# EAGLE design modul_relais (EAGLE 7.7.0)

## Sheet 1 of 3
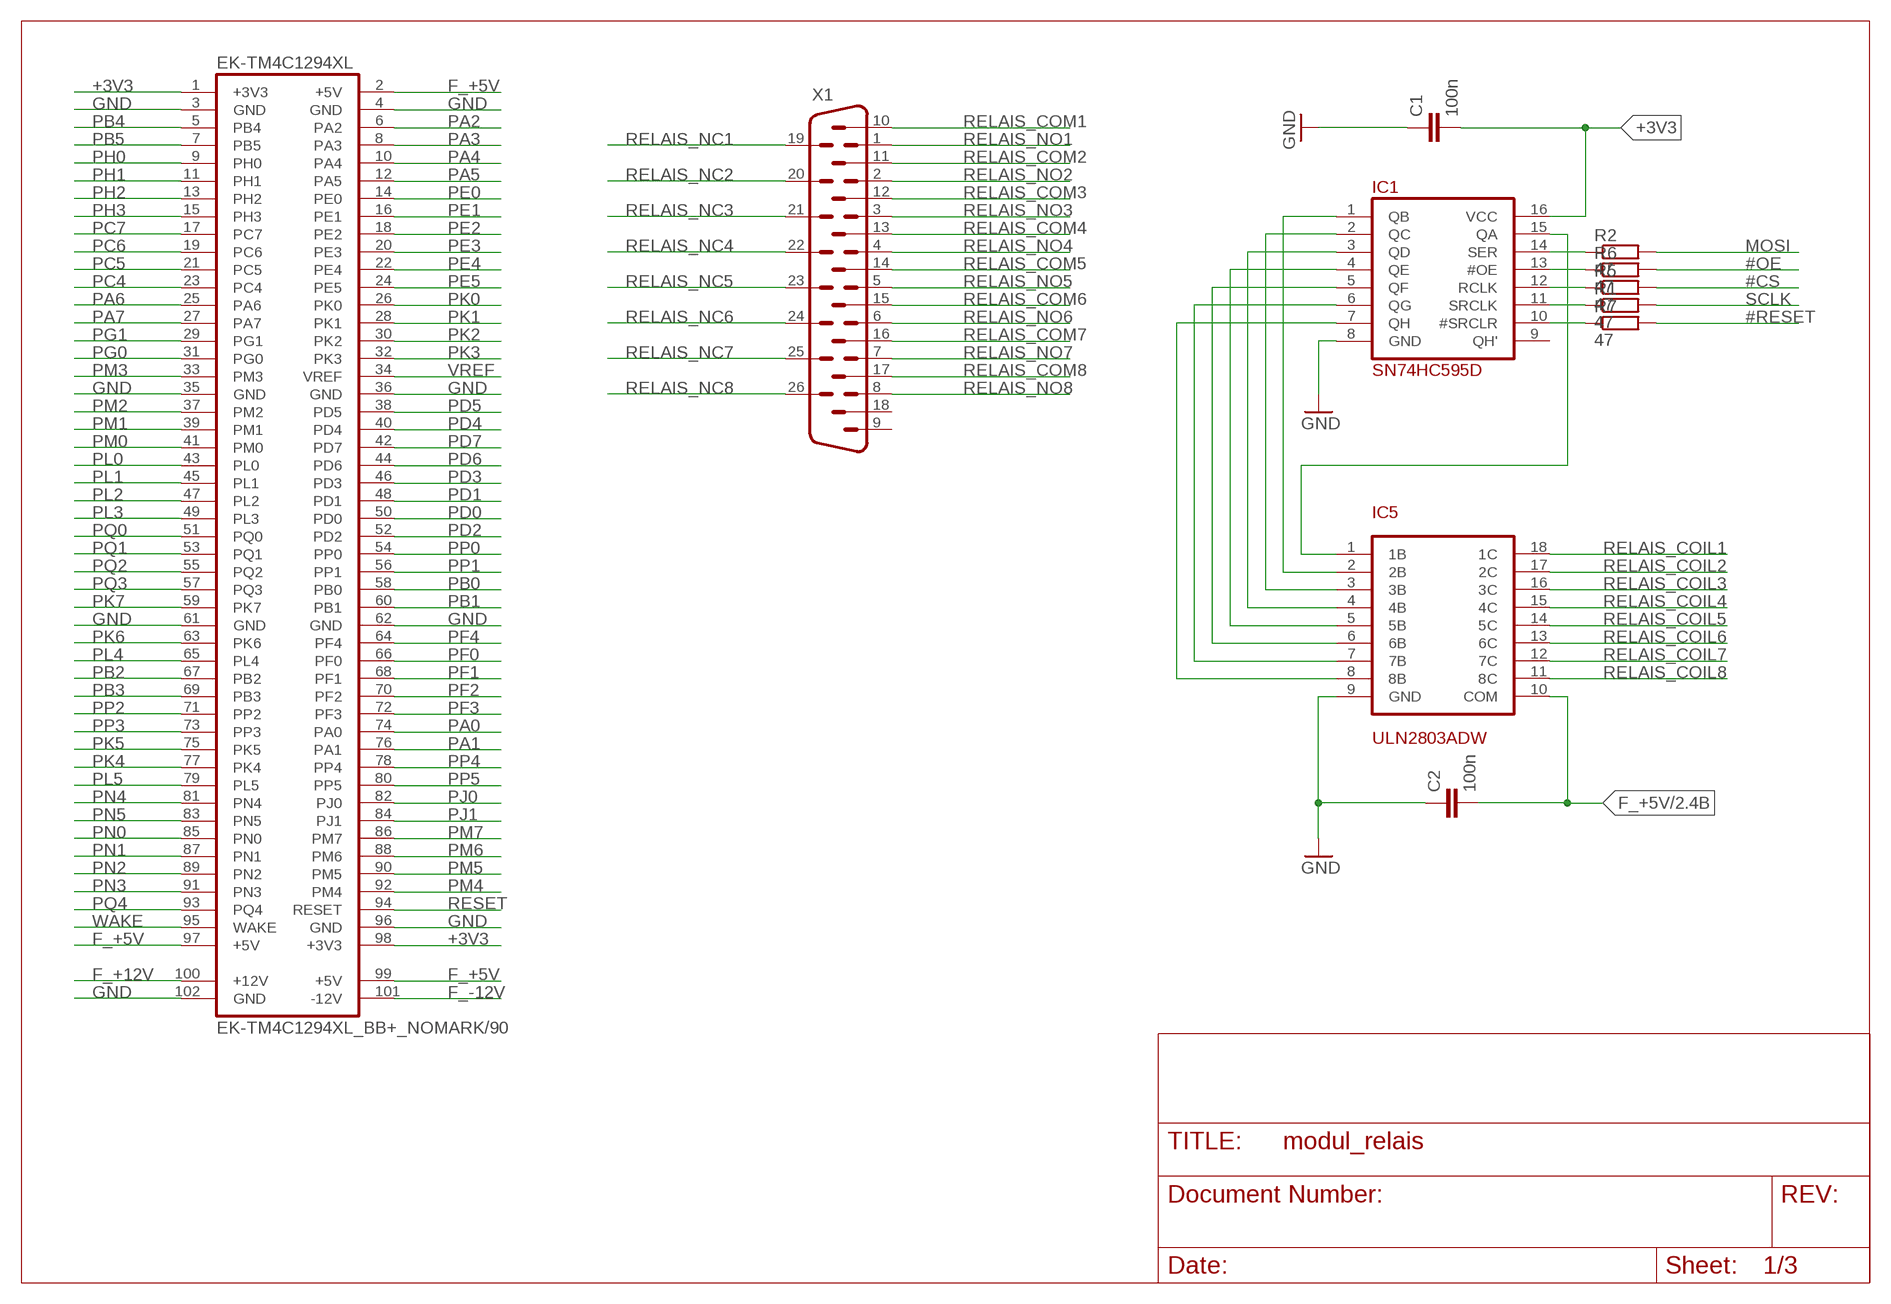
[diagram p0: schematic, sheet 1]

### Parts
C1  100n  C-EUC0805  [C0805]
C2  100n  C-EUC0805  [C0805]
EK-TM4C1294XL  EK-TM4C1294XL_BB+_NOMARK/90  [EK-TM4C1294XL_BB+_NOMARK/90]
IC1  SN74HC595D  [SOIC16_D]
IC5  ULN2803ADW  [SOIC18_DW]
R1  47  R-EU_R0805  [R0805]
R2  47  R-EU_R0805  [R0805]
R5  47  R-EU_R0805  [R0805]
R6  47  R-EU_R0805  [R0805]
R7  47  R-EU_R0805  [R0805]
X1  HM26H  [HDM26H]

### Nets
#CS: R5.2 ; also sheet 3
#OE: R6.2 ; also sheet 3
#RESET: R7.2 ; also sheet 3
+3V3: C1.2 EK-TM4C1294XL.1(+3V3) EK-TM4C1294XL.98(+3V3) IC1.16(VCC) ; also sheet 3
F_+5V: C2.2 EK-TM4C1294XL.2(+5V) EK-TM4C1294XL.97(+5V) EK-TM4C1294XL.99(+5V) IC5.10(COM) ; also sheet 2,3
F_+12V: EK-TM4C1294XL.100(+12V) ; also sheet 3
F_-12V: EK-TM4C1294XL.101(-12V) ; also sheet 3
GND: C1.1 C2.1 EK-TM4C1294XL.3(GND) EK-TM4C1294XL.4(GND) EK-TM4C1294XL.35(GND) EK-TM4C1294XL.36(GND) EK-TM4C1294XL.61(GND) EK-TM4C1294XL.62(GND) EK-TM4C1294XL.96(GND) EK-TM4C1294XL.102(GND) IC1.8(GND) IC5.9(GND) ; also sheet 2,3
MOSI: R2.2 ; also sheet 2
N$1: IC1.14(SER) R2.1
N$2: IC1.13(#OE) R6.1
N$3: IC1.12(RCLK) R5.1
N$4: IC1.11(SRCLK) R1.1
N$5: IC1.10(#SRCLR) R7.1
N$6: IC1.15(QA) IC5.1(1B)
N$7: IC1.1(QB) IC5.2(2B)
N$8: IC1.2(QC) IC5.3(3B)
N$9: IC1.3(QD) IC5.4(4B)
N$11: IC1.4(QE) IC5.5(5B)
N$13: IC1.5(QF) IC5.6(6B)
N$14: IC1.6(QG) IC5.7(7B)
N$15: IC1.7(QH) IC5.8(8B)
PA0: EK-TM4C1294XL.74(PA0) ; also sheet 3
PA1: EK-TM4C1294XL.76(PA1) ; also sheet 3
PA2: EK-TM4C1294XL.6(PA2) ; also sheet 2,3
PA3: EK-TM4C1294XL.8(PA3) ; also sheet 3
PA4: EK-TM4C1294XL.10(PA4) ; also sheet 2,3
PA5: EK-TM4C1294XL.12(PA5) ; also sheet 2,3
PA6: EK-TM4C1294XL.25(PA6) ; also sheet 3
PA7: EK-TM4C1294XL.27(PA7) ; also sheet 3
PB0: EK-TM4C1294XL.58(PB0) ; also sheet 3
PB1: EK-TM4C1294XL.60(PB1) ; also sheet 3
PB2: EK-TM4C1294XL.67(PB2) ; also sheet 3
PB3: EK-TM4C1294XL.69(PB3) ; also sheet 3
PB4: EK-TM4C1294XL.5(PB4) ; also sheet 3
PB5: EK-TM4C1294XL.7(PB5) ; also sheet 2,3
PC4: EK-TM4C1294XL.23(PC4) ; also sheet 3
PC5: EK-TM4C1294XL.21(PC5) ; also sheet 3
PC6: EK-TM4C1294XL.19(PC6) ; also sheet 3
PC7: EK-TM4C1294XL.17(PC7) ; also sheet 3
PD0: EK-TM4C1294XL.50(PD0) ; also sheet 2,3
PD1: EK-TM4C1294XL.48(PD1) ; also sheet 2,3
PD2: EK-TM4C1294XL.52(PD2) ; also sheet 3
PD3: EK-TM4C1294XL.46(PD3) ; also sheet 2,3
PD4: EK-TM4C1294XL.40(PD4) ; also sheet 3
PD5: EK-TM4C1294XL.38(PD5) ; also sheet 3
PD6: EK-TM4C1294XL.44(PD6) ; also sheet 3
PD7: EK-TM4C1294XL.42(PD7) ; also sheet 3
PE0: EK-TM4C1294XL.14(PE0) ; also sheet 3
PE1: EK-TM4C1294XL.16(PE1) ; also sheet 3
PE2: EK-TM4C1294XL.18(PE2) ; also sheet 3
PE3: EK-TM4C1294XL.20(PE3) ; also sheet 3
PE4: EK-TM4C1294XL.22(PE4) ; also sheet 2,3
PE5: EK-TM4C1294XL.24(PE5) ; also sheet 2,3
PF0: EK-TM4C1294XL.66(PF0) ; also sheet 3
PF1: EK-TM4C1294XL.68(PF1) ; also sheet 3
PF2: EK-TM4C1294XL.70(PF2) ; also sheet 3
PF3: EK-TM4C1294XL.72(PF3) ; also sheet 3
PF4: EK-TM4C1294XL.64(PF4) ; also sheet 3
PG0: EK-TM4C1294XL.31(PG0) ; also sheet 3
PG1: EK-TM4C1294XL.29(PG1) ; also sheet 3
PH0: EK-TM4C1294XL.9(PH0) ; also sheet 3
PH1: EK-TM4C1294XL.11(PH1) ; also sheet 3
PH2: EK-TM4C1294XL.13(PH2) ; also sheet 3
PH3: EK-TM4C1294XL.15(PH3) ; also sheet 3
PJ0: EK-TM4C1294XL.82(PJ0) ; also sheet 3
PJ1: EK-TM4C1294XL.84(PJ1) ; also sheet 3
PK0: EK-TM4C1294XL.26(PK0) ; also sheet 3
PK1: EK-TM4C1294XL.28(PK1) ; also sheet 3
PK2: EK-TM4C1294XL.30(PK2) ; also sheet 3
PK3: EK-TM4C1294XL.32(PK3) ; also sheet 3
PK4: EK-TM4C1294XL.77(PK4) ; also sheet 3
PK5: EK-TM4C1294XL.75(PK5) ; also sheet 3
PK6: EK-TM4C1294XL.63(PK6) ; also sheet 3
PK7: EK-TM4C1294XL.59(PK7) ; also sheet 3
PL0: EK-TM4C1294XL.43(PL0) ; also sheet 3
PL1: EK-TM4C1294XL.45(PL1) ; also sheet 3
PL2: EK-TM4C1294XL.47(PL2) ; also sheet 3
PL3: EK-TM4C1294XL.49(PL3) ; also sheet 3
PL4: EK-TM4C1294XL.65(PL4) ; also sheet 3
PL5: EK-TM4C1294XL.79(PL5) ; also sheet 3
PM0: EK-TM4C1294XL.41(PM0) ; also sheet 3
PM1: EK-TM4C1294XL.39(PM1) ; also sheet 3
PM2: EK-TM4C1294XL.37(PM2) ; also sheet 3
PM3: EK-TM4C1294XL.33(PM3) ; also sheet 3
PM4: EK-TM4C1294XL.92(PM4) ; also sheet 3
PM5: EK-TM4C1294XL.90(PM5) ; also sheet 3
PM6: EK-TM4C1294XL.88(PM6) ; also sheet 3
PM7: EK-TM4C1294XL.86(PM7) ; also sheet 3
PN0: EK-TM4C1294XL.85(PN0) ; also sheet 3
PN1: EK-TM4C1294XL.87(PN1) ; also sheet 3
PN2: EK-TM4C1294XL.89(PN2) ; also sheet 3
PN3: EK-TM4C1294XL.91(PN3) ; also sheet 3
PN4: EK-TM4C1294XL.81(PN4) ; also sheet 3
PN5: EK-TM4C1294XL.83(PN5) ; also sheet 3
PP0: EK-TM4C1294XL.54(PP0) ; also sheet 3
PP1: EK-TM4C1294XL.56(PP1) ; also sheet 3
PP2: EK-TM4C1294XL.71(PP2) ; also sheet 3
PP3: EK-TM4C1294XL.73(PP3) ; also sheet 3
PP4: EK-TM4C1294XL.78(PP4) ; also sheet 3
PP5: EK-TM4C1294XL.80(PP5) ; also sheet 3
PQ0: EK-TM4C1294XL.51(PQ0) ; also sheet 2,3
PQ1: EK-TM4C1294XL.53(PQ1) ; also sheet 3
PQ2: EK-TM4C1294XL.55(PQ2) ; also sheet 2,3
PQ3: EK-TM4C1294XL.57(PQ3) ; also sheet 2,3
PQ4: EK-TM4C1294XL.93(PQ4) ; also sheet 3
RELAIS_COIL1: IC5.18(1C) ; also sheet 2
RELAIS_COIL2: IC5.17(2C) ; also sheet 2
RELAIS_COIL3: IC5.16(3C) ; also sheet 2
RELAIS_COIL4: IC5.15(4C) ; also sheet 2
RELAIS_COIL5: IC5.14(5C) ; also sheet 2
RELAIS_COIL6: IC5.13(6C) ; also sheet 2
RELAIS_COIL7: IC5.12(7C) ; also sheet 2
RELAIS_COIL8: IC5.11(8C) ; also sheet 2
RELAIS_COM1: X1.10 ; also sheet 2
RELAIS_COM2: X1.11 ; also sheet 2
RELAIS_COM3: X1.12 ; also sheet 2
RELAIS_COM4: X1.13 ; also sheet 2
RELAIS_COM5: X1.14 ; also sheet 2
RELAIS_COM6: X1.15 ; also sheet 2
RELAIS_COM7: X1.16 ; also sheet 2
RELAIS_COM8: X1.17 ; also sheet 2
RELAIS_NC1: X1.19 ; also sheet 2
RELAIS_NC2: X1.20 ; also sheet 2
RELAIS_NC3: X1.21 ; also sheet 2
RELAIS_NC4: X1.22 ; also sheet 2
RELAIS_NC5: X1.23 ; also sheet 2
RELAIS_NC6: X1.24 ; also sheet 2
RELAIS_NC7: X1.25 ; also sheet 2
RELAIS_NC8: X1.26 ; also sheet 2
RELAIS_NO1: X1.1 ; also sheet 2
RELAIS_NO2: X1.2 ; also sheet 2
RELAIS_NO3: X1.3 ; also sheet 2
RELAIS_NO4: X1.4 ; also sheet 2
RELAIS_NO5: X1.5 ; also sheet 2
RELAIS_NO6: X1.6 ; also sheet 2
RELAIS_NO7: X1.7 ; also sheet 2
RELAIS_NO8: X1.8 ; also sheet 2
RESET: EK-TM4C1294XL.94(RESET) ; also sheet 3
SCLK: R1.2 ; also sheet 2
VREF: EK-TM4C1294XL.34(VREF) ; also sheet 3
WAKE: EK-TM4C1294XL.95(WAKE) ; also sheet 3
Unconnected: IC1.9(QH') X1.9 X1.18

## Sheet 2 of 3
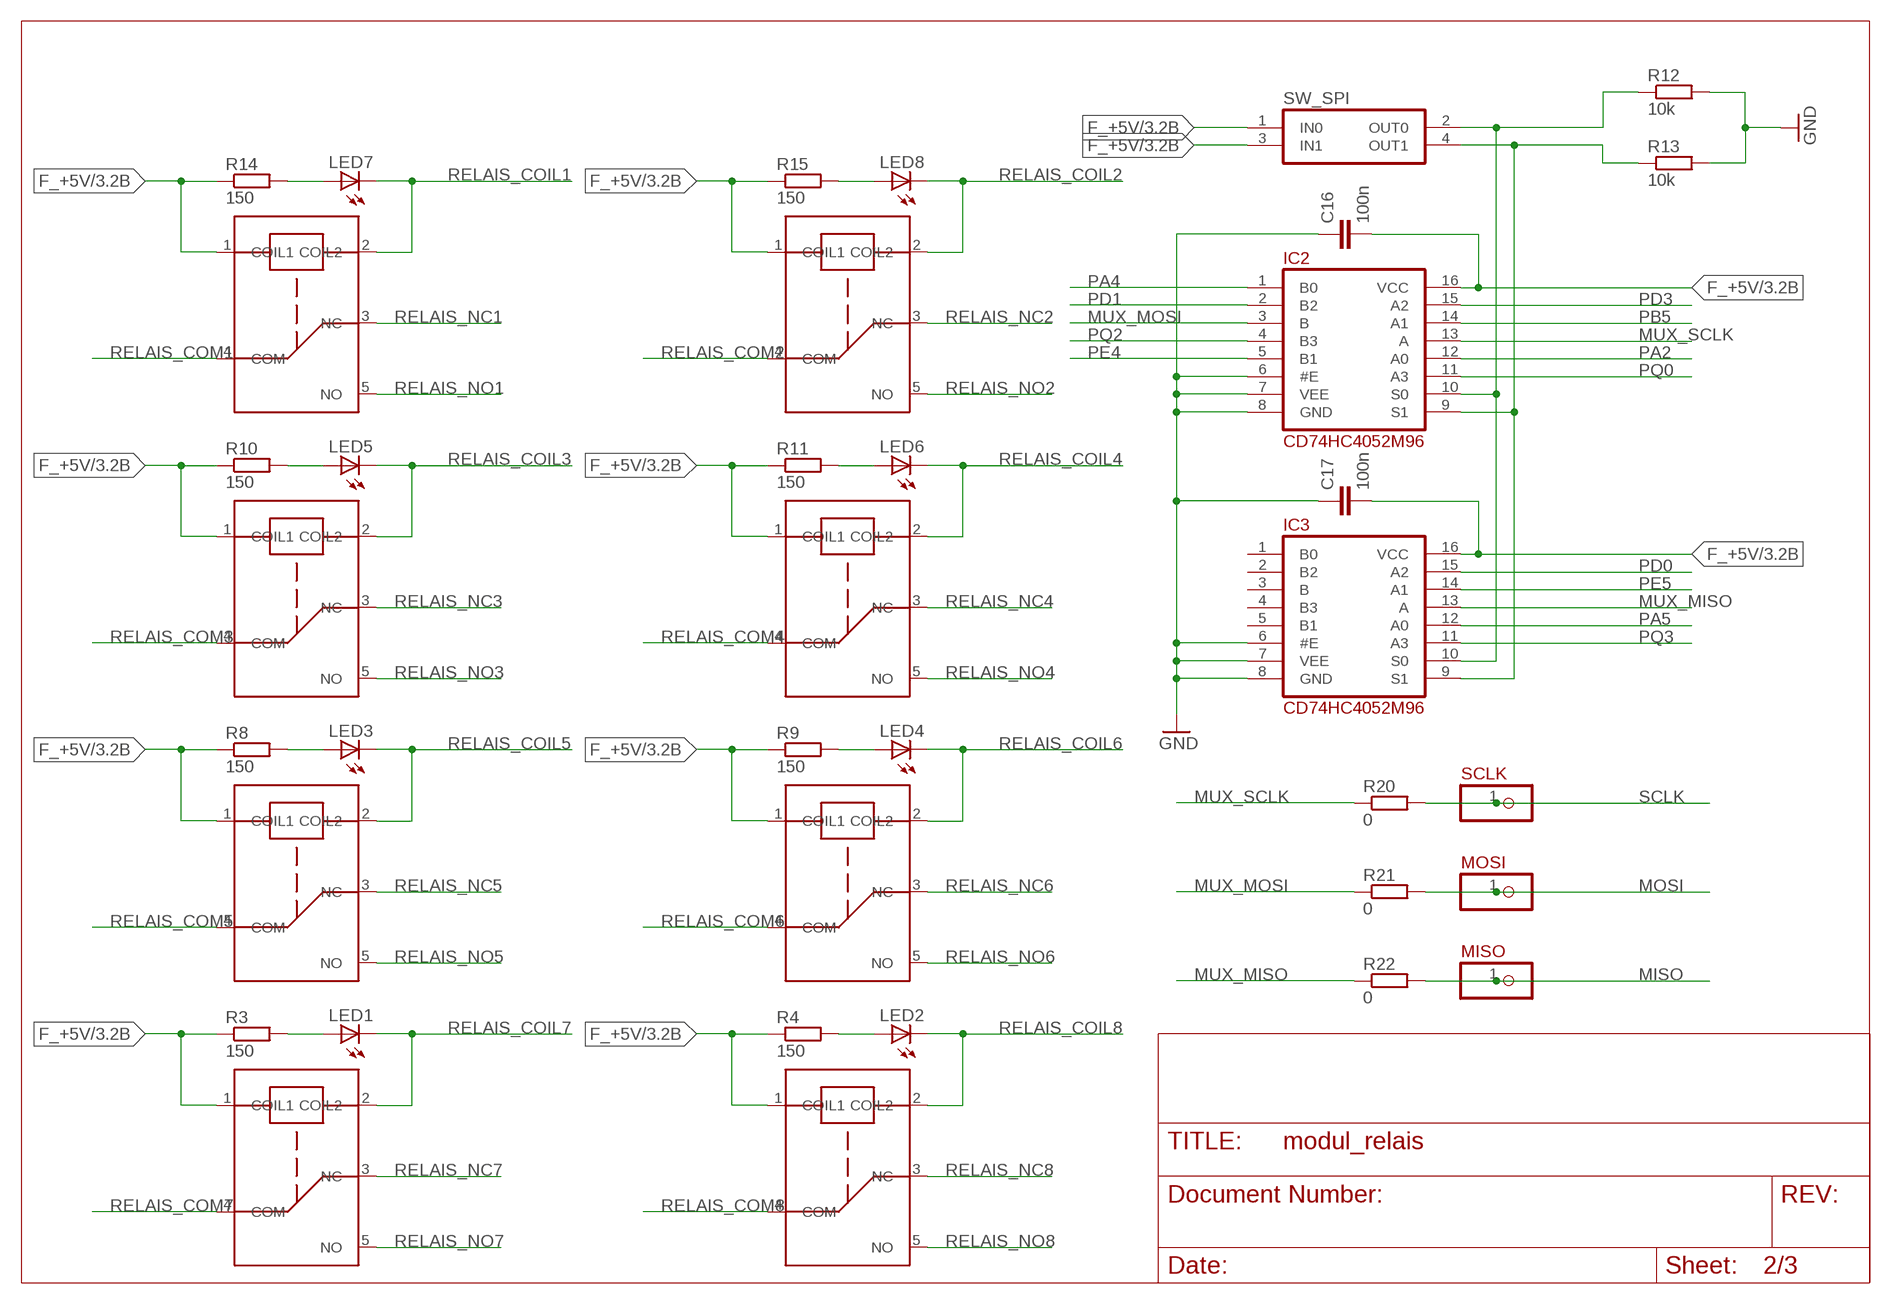
[diagram p1: schematic, sheet 2]

### Parts
C16  100n  C-EUC0805  [C0805]
C17  100n  C-EUC0805  [C0805]
IC2  CD74HC4052M96  [SOIC16_D]
IC3  CD74HC4052M96  [SOIC16_D]
LED1  LEDCHIP-LED0805  [CHIP-LED0805]
LED2  LEDCHIP-LED0805  [CHIP-LED0805]
LED3  LEDCHIP-LED0805  [CHIP-LED0805]
LED4  LEDCHIP-LED0805  [CHIP-LED0805]
LED5  LEDCHIP-LED0805  [CHIP-LED0805]
LED6  LEDCHIP-LED0805  [CHIP-LED0805]
LED7  LEDCHIP-LED0805  [CHIP-LED0805]
LED8  LEDCHIP-LED0805  [CHIP-LED0805]
MISO  PINH-1X1  [1X1]
MOSI  PINH-1X1  [1X1]
R3  150  R-EU_R0805  [R0805]
R4  150  R-EU_R0805  [R0805]
R8  150  R-EU_R0805  [R0805]
R9  150  R-EU_R0805  [R0805]
R10  150  R-EU_R0805  [R0805]
R11  150  R-EU_R0805  [R0805]
R12  10k  R-EU_R0805  [R0805]
R13  10k  R-EU_R0805  [R0805]
R14  150  R-EU_R0805  [R0805]
R15  150  R-EU_R0805  [R0805]
R20  0  R-EU_R0805  [R0805]
R21  0  R-EU_R0805  [R0805]
R22  0  R-EU_R0805  [R0805]
SCLK  PINH-1X1  [1X1]
SW_SPI  NT02  [NT02]
U$1  APF30  [RELAIS]
U$2  APF30  [RELAIS]
U$3  APF30  [RELAIS]
U$4  APF30  [RELAIS]
U$5  APF30  [RELAIS]
U$6  APF30  [RELAIS]
U$7  APF30  [RELAIS]
U$8  APF30  [RELAIS]

### Nets
F_+5V: C16.2 C17.2 IC2.16(VCC) IC3.16(VCC) R3.1 R4.1 R8.1 R9.1 R10.1 R11.1 R14.1 R15.1 SW_SPI.1(IN0) SW_SPI.3(IN1) U$1.1(COIL1) U$2.1(COIL1) U$3.1(COIL1) U$4.1(COIL1) U$5.1(COIL1) U$6.1(COIL1) U$7.1(COIL1) U$8.1(COIL1) ; also sheet 1,3
GND: C16.1 C17.1 IC2.6(#E) IC2.7(VEE) IC2.8(GND) IC3.6(#E) IC3.7(VEE) IC3.8(GND) R12.2 R13.2 ; also sheet 1,3
MISO: MISO.1 R22.2
MOSI: MOSI.1 R21.2 ; also sheet 1
MUX_MISO: IC3.13(A) R22.1
MUX_MOSI: IC2.3(B) R21.1
MUX_SCLK: IC2.13(A) R20.1
N$16: IC2.10(S0) IC3.10(S0) R12.1 SW_SPI.2(OUT0)
N$17: IC2.9(S1) IC3.9(S1) R13.1 SW_SPI.4(OUT1)
N$19: LED2.A R4.2
N$20: LED1.A R3.2
N$21: LED3.A R8.2
N$22: LED4.A R9.2
N$23: LED5.A R10.2
N$25: LED6.A R11.2
N$26: LED7.A R14.2
N$27: LED8.A R15.2
PA2: IC2.12(A0) ; also sheet 1,3
PA4: IC2.1(B0) ; also sheet 1,3
PA5: IC3.12(A0) ; also sheet 1,3
PB5: IC2.14(A1) ; also sheet 1,3
PD0: IC3.15(A2) ; also sheet 1,3
PD1: IC2.2(B2) ; also sheet 1,3
PD3: IC2.15(A2) ; also sheet 1,3
PE4: IC2.5(B1) ; also sheet 1,3
PE5: IC3.14(A1) ; also sheet 1,3
PQ0: IC2.11(A3) ; also sheet 1,3
PQ2: IC2.4(B3) ; also sheet 1,3
PQ3: IC3.11(A3) ; also sheet 1,3
RELAIS_COIL1: LED7.C U$7.2(COIL2) ; also sheet 1
RELAIS_COIL2: LED8.C U$8.2(COIL2) ; also sheet 1
RELAIS_COIL3: LED5.C U$5.2(COIL2) ; also sheet 1
RELAIS_COIL4: LED6.C U$6.2(COIL2) ; also sheet 1
RELAIS_COIL5: LED3.C U$3.2(COIL2) ; also sheet 1
RELAIS_COIL6: LED4.C U$4.2(COIL2) ; also sheet 1
RELAIS_COIL7: LED1.C U$1.2(COIL2) ; also sheet 1
RELAIS_COIL8: LED2.C U$2.2(COIL2) ; also sheet 1
RELAIS_COM1: U$7.4(COM) ; also sheet 1
RELAIS_COM2: U$8.4(COM) ; also sheet 1
RELAIS_COM3: U$5.4(COM) ; also sheet 1
RELAIS_COM4: U$6.4(COM) ; also sheet 1
RELAIS_COM5: U$3.4(COM) ; also sheet 1
RELAIS_COM6: U$4.4(COM) ; also sheet 1
RELAIS_COM7: U$1.4(COM) ; also sheet 1
RELAIS_COM8: U$2.4(COM) ; also sheet 1
RELAIS_NC1: U$7.3(NC) ; also sheet 1
RELAIS_NC2: U$8.3(NC) ; also sheet 1
RELAIS_NC3: U$5.3(NC) ; also sheet 1
RELAIS_NC4: U$6.3(NC) ; also sheet 1
RELAIS_NC5: U$3.3(NC) ; also sheet 1
RELAIS_NC6: U$4.3(NC) ; also sheet 1
RELAIS_NC7: U$1.3(NC) ; also sheet 1
RELAIS_NC8: U$2.3(NC) ; also sheet 1
RELAIS_NO1: U$7.5(NO) ; also sheet 1
RELAIS_NO2: U$8.5(NO) ; also sheet 1
RELAIS_NO3: U$5.5(NO) ; also sheet 1
RELAIS_NO4: U$6.5(NO) ; also sheet 1
RELAIS_NO5: U$3.5(NO) ; also sheet 1
RELAIS_NO6: U$4.5(NO) ; also sheet 1
RELAIS_NO7: U$1.5(NO) ; also sheet 1
RELAIS_NO8: U$2.5(NO) ; also sheet 1
SCLK: R20.2 SCLK.1 ; also sheet 1
Unconnected: IC3.1(B0) IC3.2(B2) IC3.3(B) IC3.4(B3) IC3.5(B1)

## Sheet 3 of 3
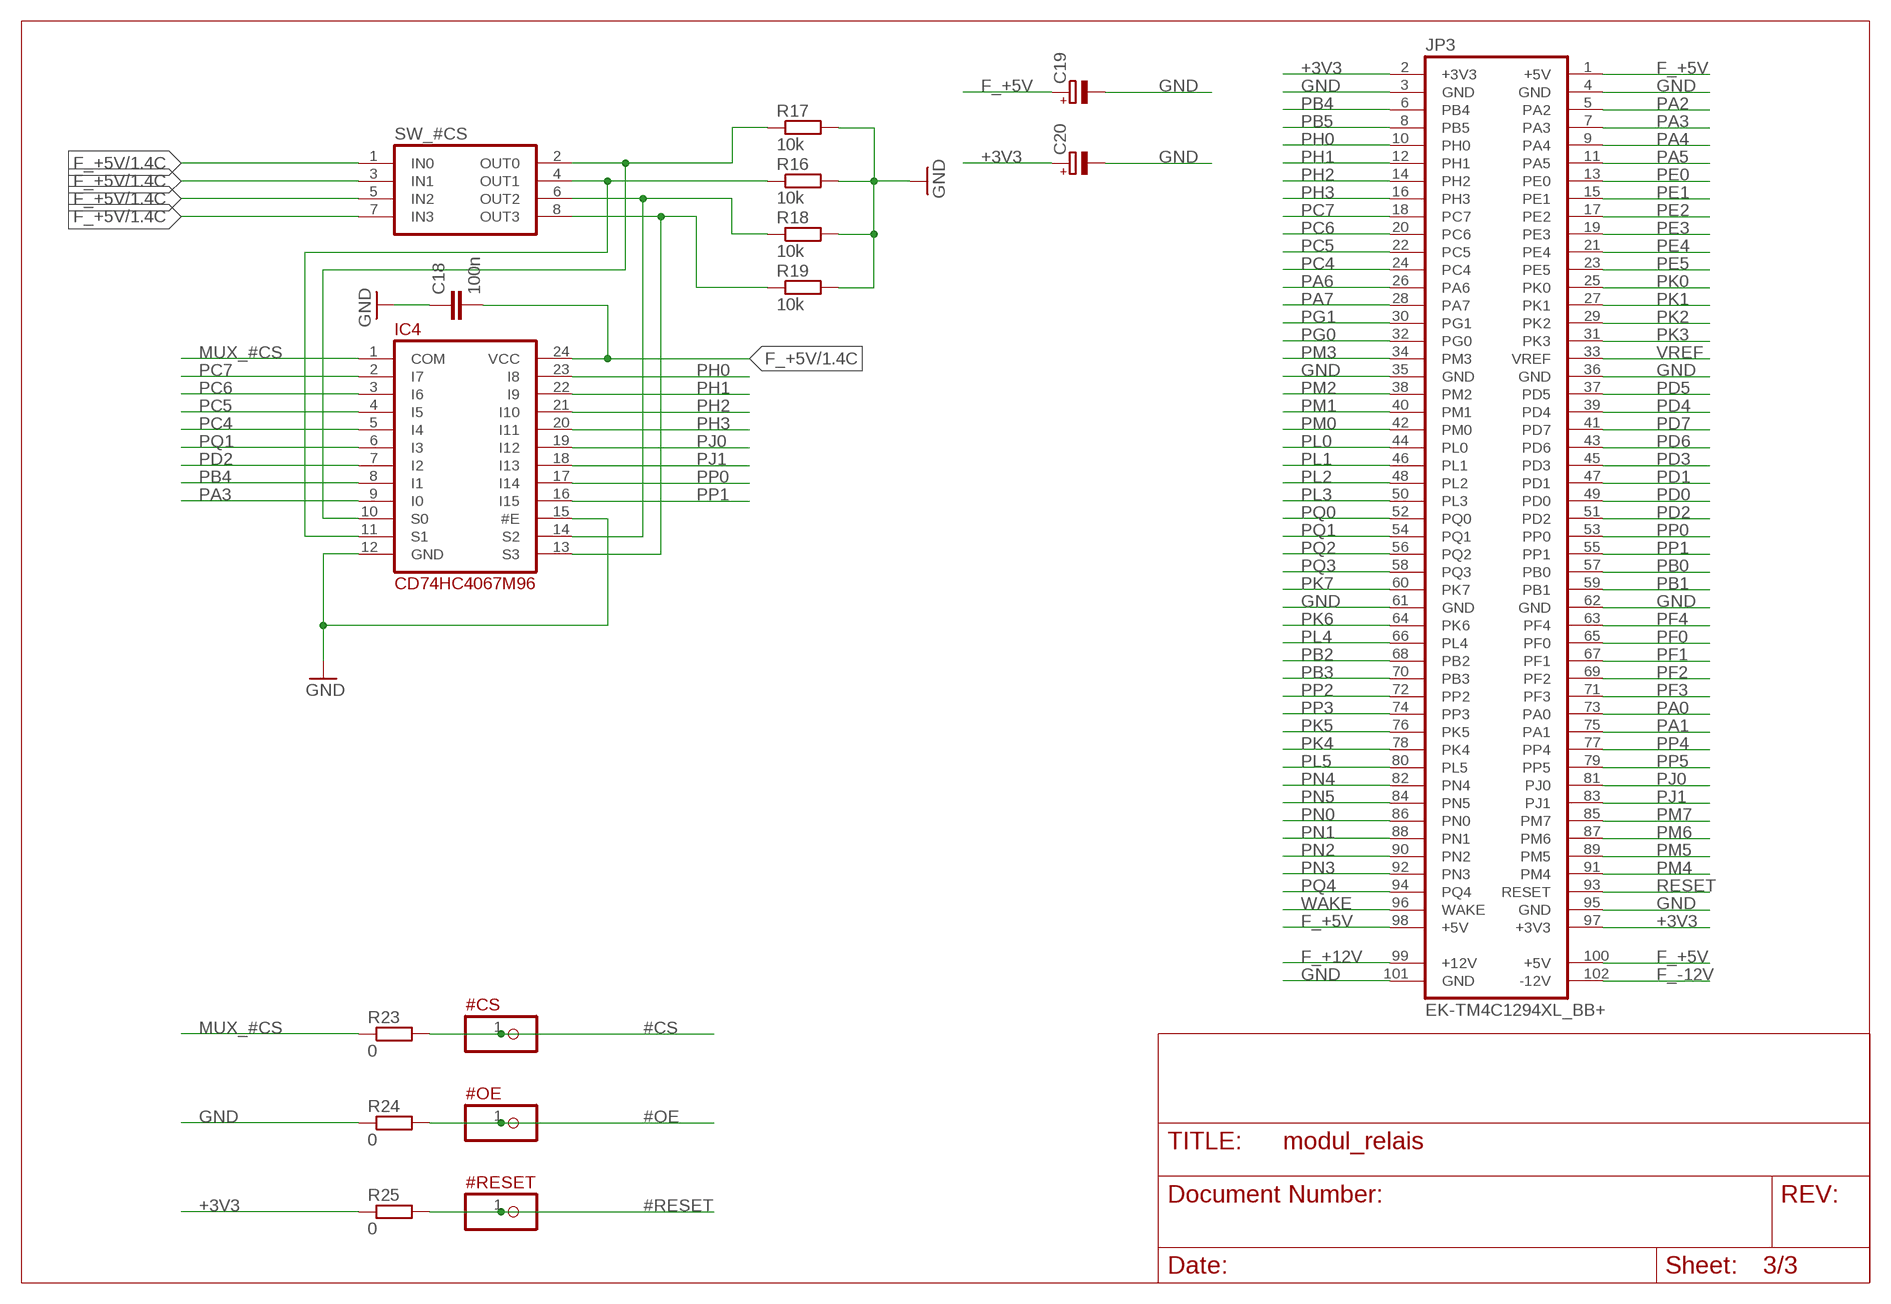
[diagram p2: schematic, sheet 3]

### Parts
#CS  PINH-1X1  [1X1]
#OE  PINH-1X1  [1X1]
#RESET  PINH-1X1  [1X1]
C18  100n  C-EUC0805  [C0805]
C19  CPOL-EUE2.5-6  [E2,5-6]
C20  CPOL-EUE2.5-6  [E2,5-6]
IC4  CD74HC4067M96  [SOIC24_DW]
JP3  EK-TM4C1294XL_BB+  [EK-TM4C1294XL_BB+]
R16  10k  R-EU_R0805  [R0805]
R17  10k  R-EU_R0805  [R0805]
R18  10k  R-EU_R0805  [R0805]
R19  10k  R-EU_R0805  [R0805]
R23  0  R-EU_R0805  [R0805]
R24  0  R-EU_R0805  [R0805]
R25  0  R-EU_R0805  [R0805]
SW_#CS  NT04  [NT04]

### Nets
#CS: #CS.1 R23.2 ; also sheet 1
#OE: #OE.1 R24.2 ; also sheet 1
#RESET: #RESET.1 R25.2 ; also sheet 1
+3V3: C20.+ JP3.2(+3V3) JP3.97(+3V3) R25.1 ; also sheet 1
F_+5V: C18.2 C19.+ IC4.24(VCC) JP3.1(+5V) JP3.98(+5V) JP3.100(+5V) SW_#CS.1(IN0) SW_#CS.3(IN1) SW_#CS.5(IN2) SW_#CS.7(IN3) ; also sheet 1,2
F_+12V: JP3.99(+12V) ; also sheet 1
F_-12V: JP3.102(-12V) ; also sheet 1
GND: C18.1 C19.- C20.- IC4.12(GND) IC4.15(#E) JP3.3(GND) JP3.4(GND) JP3.35(GND) JP3.36(GND) JP3.61(GND) JP3.62(GND) JP3.95(GND) JP3.101(GND) R16.2 R17.2 R18.2 R19.2 R24.1 ; also sheet 1,2
MUX_#CS: IC4.1(COM) R23.1
N$10: IC4.11(S1) R16.1 SW_#CS.4(OUT1)
N$12: IC4.10(S0) R17.1 SW_#CS.2(OUT0)
N$18: IC4.14(S2) R18.1 SW_#CS.6(OUT2)
N$24: IC4.13(S3) R19.1 SW_#CS.8(OUT3)
PA0: JP3.73(PA0) ; also sheet 1
PA1: JP3.75(PA1) ; also sheet 1
PA2: JP3.5(PA2) ; also sheet 1,2
PA3: IC4.9(I0) JP3.7(PA3) ; also sheet 1
PA4: JP3.9(PA4) ; also sheet 1,2
PA5: JP3.11(PA5) ; also sheet 1,2
PA6: JP3.26(PA6) ; also sheet 1
PA7: JP3.28(PA7) ; also sheet 1
PB0: JP3.57(PB0) ; also sheet 1
PB1: JP3.59(PB1) ; also sheet 1
PB2: JP3.68(PB2) ; also sheet 1
PB3: JP3.70(PB3) ; also sheet 1
PB4: IC4.8(I1) JP3.6(PB4) ; also sheet 1
PB5: JP3.8(PB5) ; also sheet 1,2
PC4: IC4.5(I4) JP3.24(PC4) ; also sheet 1
PC5: IC4.4(I5) JP3.22(PC5) ; also sheet 1
PC6: IC4.3(I6) JP3.20(PC6) ; also sheet 1
PC7: IC4.2(I7) JP3.18(PC7) ; also sheet 1
PD0: JP3.49(PD0) ; also sheet 1,2
PD1: JP3.47(PD1) ; also sheet 1,2
PD2: IC4.7(I2) JP3.51(PD2) ; also sheet 1
PD3: JP3.45(PD3) ; also sheet 1,2
PD4: JP3.39(PD4) ; also sheet 1
PD5: JP3.37(PD5) ; also sheet 1
PD6: JP3.43(PD6) ; also sheet 1
PD7: JP3.41(PD7) ; also sheet 1
PE0: JP3.13(PE0) ; also sheet 1
PE1: JP3.15(PE1) ; also sheet 1
PE2: JP3.17(PE2) ; also sheet 1
PE3: JP3.19(PE3) ; also sheet 1
PE4: JP3.21(PE4) ; also sheet 1,2
PE5: JP3.23(PE5) ; also sheet 1,2
PF0: JP3.65(PF0) ; also sheet 1
PF1: JP3.67(PF1) ; also sheet 1
PF2: JP3.69(PF2) ; also sheet 1
PF3: JP3.71(PF3) ; also sheet 1
PF4: JP3.63(PF4) ; also sheet 1
PG0: JP3.32(PG0) ; also sheet 1
PG1: JP3.30(PG1) ; also sheet 1
PH0: IC4.23(I8) JP3.10(PH0) ; also sheet 1
PH1: IC4.22(I9) JP3.12(PH1) ; also sheet 1
PH2: IC4.21(I10) JP3.14(PH2) ; also sheet 1
PH3: IC4.20(I11) JP3.16(PH3) ; also sheet 1
PJ0: IC4.19(I12) JP3.81(PJ0) ; also sheet 1
PJ1: IC4.18(I13) JP3.83(PJ1) ; also sheet 1
PK0: JP3.25(PK0) ; also sheet 1
PK1: JP3.27(PK1) ; also sheet 1
PK2: JP3.29(PK2) ; also sheet 1
PK3: JP3.31(PK3) ; also sheet 1
PK4: JP3.78(PK4) ; also sheet 1
PK5: JP3.76(PK5) ; also sheet 1
PK6: JP3.64(PK6) ; also sheet 1
PK7: JP3.60(PK7) ; also sheet 1
PL0: JP3.44(PL0) ; also sheet 1
PL1: JP3.46(PL1) ; also sheet 1
PL2: JP3.48(PL2) ; also sheet 1
PL3: JP3.50(PL3) ; also sheet 1
PL4: JP3.66(PL4) ; also sheet 1
PL5: JP3.80(PL5) ; also sheet 1
PM0: JP3.42(PM0) ; also sheet 1
PM1: JP3.40(PM1) ; also sheet 1
PM2: JP3.38(PM2) ; also sheet 1
PM3: JP3.34(PM3) ; also sheet 1
PM4: JP3.91(PM4) ; also sheet 1
PM5: JP3.89(PM5) ; also sheet 1
PM6: JP3.87(PM6) ; also sheet 1
PM7: JP3.85(PM7) ; also sheet 1
PN0: JP3.86(PN0) ; also sheet 1
PN1: JP3.88(PN1) ; also sheet 1
PN2: JP3.90(PN2) ; also sheet 1
PN3: JP3.92(PN3) ; also sheet 1
PN4: JP3.82(PN4) ; also sheet 1
PN5: JP3.84(PN5) ; also sheet 1
PP0: IC4.17(I14) JP3.53(PP0) ; also sheet 1
PP1: IC4.16(I15) JP3.55(PP1) ; also sheet 1
PP2: JP3.72(PP2) ; also sheet 1
PP3: JP3.74(PP3) ; also sheet 1
PP4: JP3.77(PP4) ; also sheet 1
PP5: JP3.79(PP5) ; also sheet 1
PQ0: JP3.52(PQ0) ; also sheet 1,2
PQ1: IC4.6(I3) JP3.54(PQ1) ; also sheet 1
PQ2: JP3.56(PQ2) ; also sheet 1,2
PQ3: JP3.58(PQ3) ; also sheet 1,2
PQ4: JP3.94(PQ4) ; also sheet 1
RESET: JP3.93(RESET) ; also sheet 1
VREF: JP3.33(VREF) ; also sheet 1
WAKE: JP3.96(WAKE) ; also sheet 1

## Library data of the parts
#CS #OE #RESET MISO MOSI SCLK = ownparts:PINH-1X1*: 1x1 pol. Stiftleisten, RM 2.54
C1 C2 C16-C18 = rcl:C-EU: CAPACITOR, European symbol
C19 C20 = rcl:CPOL-EU: POLARIZED CAPACITOR, European symbol
EK-TM4C1294XL JP3 = ownparts:EK-TM4C1294XL_BB+
IC1 = ownparts:SN74HC595*
IC2 IC3 = ownparts:CD74HC4052*
IC4 = ownparts:CD74HC4067*
IC5 = ownparts:ULN2803A
LED1-LED8 = led:LED: LED
R1-R25 = rcl:R-EU_: RESISTOR, European symbol
SW_#CS = ownparts:NT04
SW_SPI = ownparts:NT02
U$1-U$8 = ownparts:APF30
X1 = con-subd:HM26: SUB-D; OC_FARNELL: unknown; OC_NEWARK: unknown

## Board
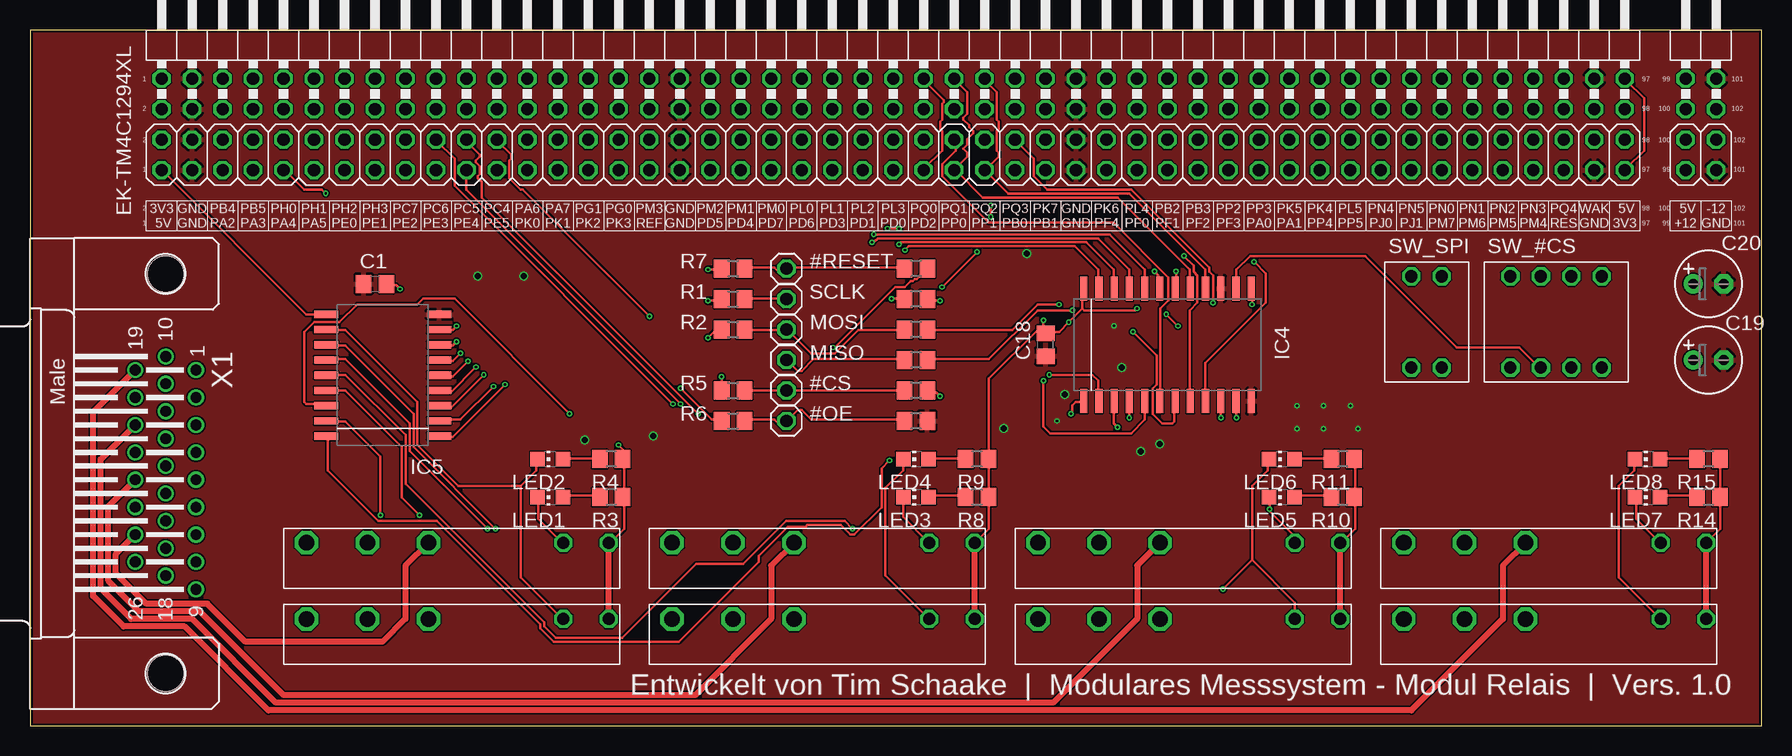
[diagram p3: board, top side]
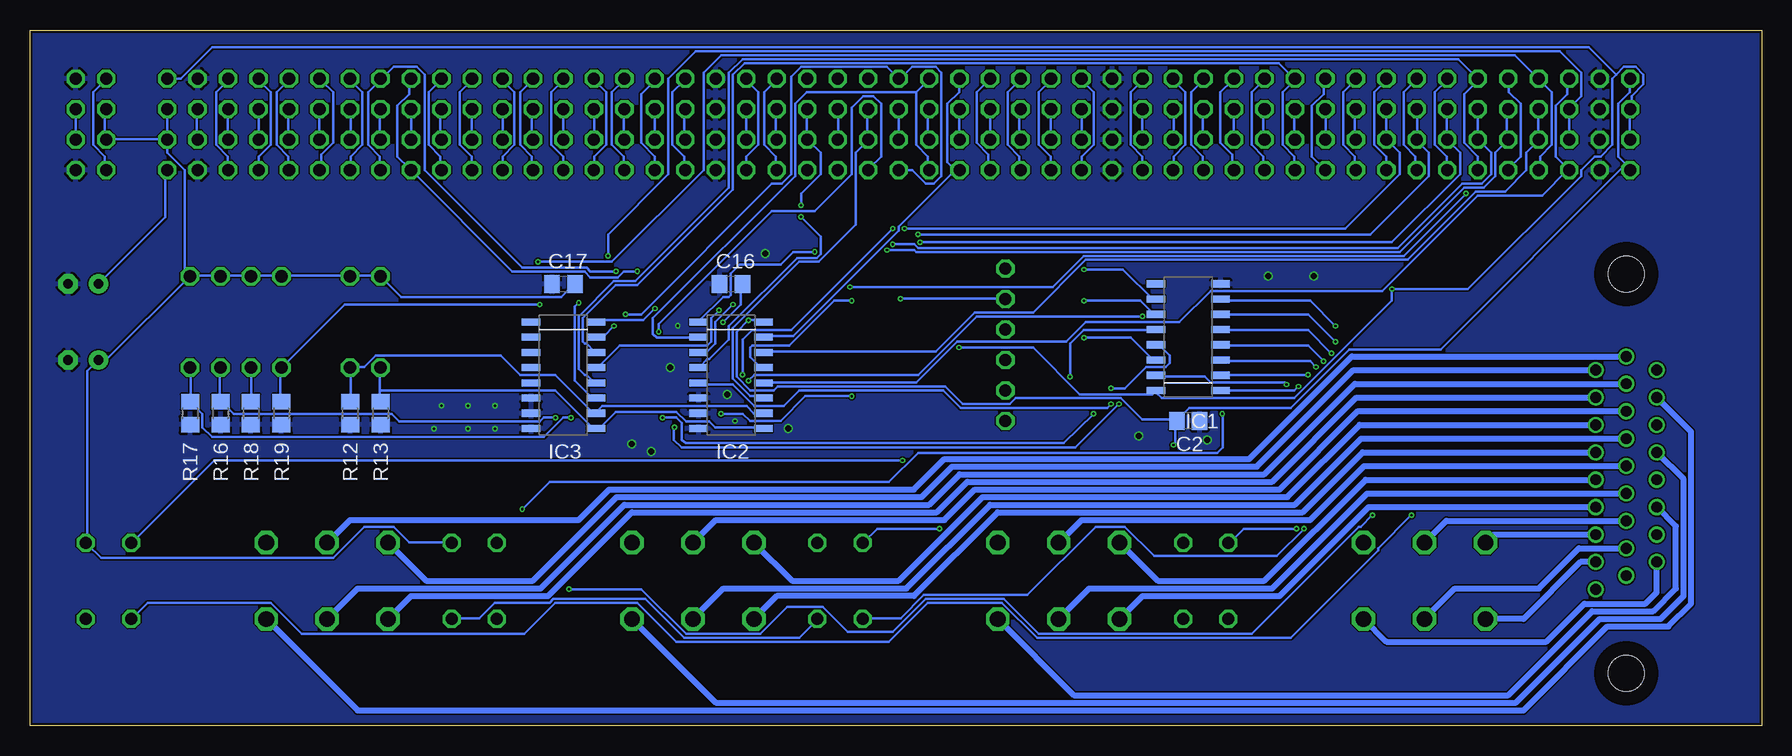
[diagram p4: board, bottom side, seen from below]

Size 144.32 x 58 mm. Coordinates in mm from the lower left corner, seen from the top.
Outline: 0,0 144.32,0 144.32,58 0,58 0,0
Copper layers (1*16): Top 0.018mm / dielectric 1.55mm / Bottom 0.018mm
Design rules "Multi-CB_2L_125um-Tracks_OL35um": minimum track width 0.125mm, minimum drill 0.2mm, track to track 0.125mm, track to pad 0.125mm, pad to pad 0.125mm, via to via 0.125mm, smd to smd 0mil, copper to edge 0.2mm, drill to drill 0.2mm, minimum pad ring 0.125mm, minimum via ring 0.125mm, stop-mask expansion 2mil, vias tented up to drill 0.45mm, thermal gap 0.2mm

### Footprints (pad centres in the part's own frame; a part is rotated, then mirrored left to right if it is on the bottom)
1X1 = drill 1.016 octagon: 1 0,0
C0805 = smd 1.3 x 1.5: 1 -0.95,0; 2 0.95,0
E2,5-6 = drill 0.813 pad 1.6: + -1.27,0 | drill 0.813 pad 1.6 octagon: - 1.27,0
EK-TM4C1294XL_BB+_NOMARK/90 = drill 1.016 octagon: 1 -60.96,-1.27; 2 -60.96,1.27; 3 -58.42,-1.27; 4 -58.42,1.27; 5 -55.88,-1.27; 6 -55.88,1.27; 7 -53.34,-1.27; 8 -53.34,1.27; 9 -50.8,-1.27; 10 -50.8,1.27; 11 -48.26,-1.27; 12 -48.26,1.27; 13 -45.72,-1.27; 14 -45.72,1.27; 15 -43.18,-1.27; 16 -43.18,1.27; 17 -40.64,-1.27; 18 -40.64,1.27; 19 -38.1,-1.27; 20 -38.1,1.27; 21 -35.56,-1.27; 22 -35.56,1.27; 23 -33.02,-1.27; 24 -33.02,1.27; 25 -30.48,-1.27; 26 -30.48,1.27; 27 -27.94,-1.27; 28 -27.94,1.27; 29 -25.4,-1.27; 30 -25.4,1.27; 31 -22.86,-1.27; 32 -22.86,1.27; 33 -20.32,-1.27; 34 -20.32,1.27; 35 -17.78,-1.27; 36 -17.78,1.27; 37 -15.24,-1.27; 38 -15.24,1.27; 39 -12.7,-1.27; 40 -12.7,1.27; 41 -10.16,-1.27; 42 -10.16,1.27; 43 -7.62,-1.27; 44 -7.62,1.27; 45 -5.08,-1.27; 46 -5.08,1.27; 47 -2.54,-1.27; 48 -2.54,1.27; 49 0,-1.27; 50 0,1.27; 51 2.54,-1.27; 52 2.54,1.27; 53 5.08,-1.27; 54 5.08,1.27; 55 7.62,-1.27; 56 7.62,1.27; 57 10.16,-1.27; 58 10.16,1.27; 59 12.7,-1.27; 60 12.7,1.27; 61 15.24,-1.27; 62 15.24,1.27; 63 17.78,-1.27; 64 17.78,1.27; 65 20.32,-1.27; 66 20.32,1.27; 67 22.86,-1.27; 68 22.86,1.27; 69 25.4,-1.27; 70 25.4,1.27; 71 27.94,-1.27; 72 27.94,1.27; 73 30.48,-1.27; 74 30.48,1.27; 75 33.02,-1.27; 76 33.02,1.27; 77 35.56,-1.27; 78 35.56,1.27; 79 38.1,-1.27; 80 38.1,1.27; 81 40.64,-1.27; 82 40.64,1.27; 83 43.18,-1.27; 84 43.18,1.27; 85 45.72,-1.27; 86 45.72,1.27; 87 48.26,-1.27; 88 48.26,1.27; 89 50.8,-1.27; 90 50.8,1.27; 91 53.34,-1.27; 92 53.34,1.27; 93 55.88,-1.27; 94 55.88,1.27; 95 58.42,-1.27; 96 58.42,1.27; 97 60.96,-1.27; 98 60.96,1.27; 99 66.04,-1.27; 100 66.04,1.27; 101 68.58,-1.27; 102 68.58,1.27
SOIC16_D = smd 0.6 x 1.55: 1 -4.445,-2.7; 2 -3.175,-2.7; 3 -1.905,-2.7; 4 -0.635,-2.7; 5 0.635,-2.7; 6 1.905,-2.7; 7 3.175,-2.7; 8 4.445,-2.7; 9 4.445,2.7; 10 3.175,2.7; 11 1.905,2.7; 12 0.635,2.7; 13 -0.635,2.7; 14 -1.905,2.7; 15 -3.175,2.7; 16 -4.445,2.7
SOIC24_DW = smd 0.6 x 2: 1 -6.985,-4.7; 2 -5.715,-4.7; 3 -4.445,-4.7; 4 -3.175,-4.7; 5 -1.905,-4.7; 6 -0.635,-4.7; 7 0.635,-4.7; 8 1.905,-4.7; 9 3.175,-4.7; 10 4.445,-4.7; 11 5.715,-4.7; 12 6.985,-4.7; 13 6.985,4.7; 14 5.715,4.7; 15 4.445,4.7; 16 3.175,4.7; 17 1.905,4.7; 18 0.635,4.7; 19 -0.635,4.7; 20 -1.905,4.7; 21 -3.175,4.7; 22 -4.445,4.7; 23 -5.715,4.7; 24 -6.985,4.7
SOIC18_DW = smd 0.6 x 2: 1 -5.08,-4.7; 2 -3.81,-4.7; 3 -2.54,-4.7; 4 -1.27,-4.7; 5 0,-4.7; 6 1.27,-4.7; 7 2.54,-4.7; 8 3.81,-4.7; 9 5.08,-4.7; 10 5.08,4.7; 11 3.81,4.7; 12 2.54,4.7; 13 1.27,4.7; 14 0,4.7; 15 -1.27,4.7; 16 -2.54,4.7; 17 -3.81,4.7; 18 -5.08,4.7
EK-TM4C1294XL_BB+ = drill 1.016 octagon: 1 -60.96,-1.27; 2 -60.96,1.27; 3 -58.42,-1.27; 4 -58.42,1.27; 5 -55.88,-1.27; 6 -55.88,1.27; 7 -53.34,-1.27; 8 -53.34,1.27; 9 -50.8,-1.27; 10 -50.8,1.27; 11 -48.26,-1.27; 12 -48.26,1.27; 13 -45.72,-1.27; 14 -45.72,1.27; 15 -43.18,-1.27; 16 -43.18,1.27; 17 -40.64,-1.27; 18 -40.64,1.27; 19 -38.1,-1.27; 20 -38.1,1.27; 21 -35.56,-1.27; 22 -35.56,1.27; 23 -33.02,-1.27; 24 -33.02,1.27; 25 -30.48,-1.27; 26 -30.48,1.27; 27 -27.94,-1.27; 28 -27.94,1.27; 29 -25.4,-1.27; 30 -25.4,1.27; 31 -22.86,-1.27; 32 -22.86,1.27; 33 -20.32,-1.27; 34 -20.32,1.27; 35 -17.78,-1.27; 36 -17.78,1.27; 37 -15.24,-1.27; 38 -15.24,1.27; 39 -12.7,-1.27; 40 -12.7,1.27; 41 -10.16,-1.27; 42 -10.16,1.27; 43 -7.62,-1.27; 44 -7.62,1.27; 45 -5.08,-1.27; 46 -5.08,1.27; 47 -2.54,-1.27; 48 -2.54,1.27; 49 0,-1.27; 50 0,1.27; 51 2.54,-1.27; 52 2.54,1.27; 53 5.08,-1.27; 54 5.08,1.27; 55 7.62,-1.27; 56 7.62,1.27; 57 10.16,-1.27; 58 10.16,1.27; 59 12.7,-1.27; 60 12.7,1.27; 61 15.24,-1.27; 62 15.24,1.27; 63 17.78,-1.27; 64 17.78,1.27; 65 20.32,-1.27; 66 20.32,1.27; 67 22.86,-1.27; 68 22.86,1.27; 69 25.4,-1.27; 70 25.4,1.27; 71 27.94,-1.27; 72 27.94,1.27; 73 30.48,-1.27; 74 30.48,1.27; 75 33.02,-1.27; 76 33.02,1.27; 77 35.56,-1.27; 78 35.56,1.27; 79 38.1,-1.27; 80 38.1,1.27; 81 40.64,-1.27; 82 40.64,1.27; 83 43.18,-1.27; 84 43.18,1.27; 85 45.72,-1.27; 86 45.72,1.27; 87 48.26,-1.27; 88 48.26,1.27; 89 50.8,-1.27; 90 50.8,1.27; 91 53.34,-1.27; 92 53.34,1.27; 93 55.88,-1.27; 94 55.88,1.27; 95 58.42,-1.27; 96 58.42,1.27; 97 60.96,-1.27; 98 60.96,1.27; 99 66.04,-1.27; 100 66.04,1.27; 101 68.58,-1.27; 102 68.58,1.27
CHIP-LED0805 = smd 1.2 x 1.2: A 0,-1.05; C 0,1.05
R0805 = smd 1.3 x 1.5: 1 -0.95,0; 2 0.95,0
NT04 = drill 1.016 octagon: 1 -3.81,-3.81; 2 -3.81,3.81; 3 -1.27,-3.81; 4 -1.27,3.81; 5 1.27,-3.81; 6 1.27,3.81; 7 3.81,-3.81; 8 3.81,3.81
NT02 = drill 1.016 octagon: 1 -1.27,-3.81; 2 -1.27,3.81; 3 1.27,-3.81; 4 1.27,3.81
RELAIS = drill 1 octagon: 1 -15.04,0; 2 -11.26,0 | drill 1.3 octagon: 3 0,0; 4 5.08,0; 5 10.16,0
HDM26H = drill 0.9: 1 -8.639,2.54; 2 -6.353,2.54; 3 -4.067,2.54; 4 -1.781,2.54; 5 0.505,2.54; 6 2.791,2.54; 7 5.077,2.54; 8 7.363,2.54; 9 9.649,2.54; 10 -9.782,0; 11 -7.496,0; 12 -5.21,0; 13 -2.924,0; 14 -0.638,0; 15 1.648,0; 16 3.934,0; 17 6.22,0; 18 8.506,0; 19 -8.639,-2.54; 20 -6.353,-2.54; 21 -4.067,-2.54; 22 -1.781,-2.54; 23 0.505,-2.54; 24 2.791,-2.54; 25 5.077,-2.54; 26 7.363,-2.54 | hole 3: -16.65,0; 16.65,0

### Placement (x,y rotation side)
#CS  63.04,27.94 0 top
#OE  63.04,25.4 0 top
#RESET  63.04,38.1 0 top
C1  28.75,36.83 0 top
C2  47.8,25.4 180 bottom
C16  85.9,36.83 0 bottom
C17  99.87,36.83 0 bottom
C18  84.63,31.75 90 top
C19  139.88,30.48 0 top
C20  139.88,36.83 0 top
EK-TM4C1294XL  71.93,52.67 0 top
IC1  47.8,32.38 90 bottom
IC2  85.9,29.21 270 bottom
IC3  99.87,29.21 270 bottom
IC4  94.79,31.75 0 top
IC5  29.38,29.21 90 top
JP3  71.93,47.59 0 top
LED1  43.36,19.05 90 top
LED2  43.36,22.23 90 top
LED3  73.84,19.05 90 top
LED4  73.84,22.23 90 top
LED5  104.31,19.05 90 top
LED6  104.31,22.23 90 top
LED7  134.79,19.05 90 top
LED8  134.79,22.23 90 top
MISO  63.04,30.48 0 top
MOSI  63.04,33.02 0 top
R1  58.59,35.56 0 top
R2  58.59,33.02 0 top
R3  48.44,19.05 180 top
R4  48.44,22.23 180 top
R5  58.59,27.94 0 top
R6  58.59,25.4 0 top
R7  58.59,38.1 0 top
R8  78.92,19.05 180 top
R9  78.92,22.23 180 top
R10  109.39,19.05 180 top
R11  109.39,22.23 180 top
R12  117.65,26.04 270 bottom
R13  115.11,26.04 270 bottom
R14  139.88,19.05 180 top
R15  139.88,22.23 180 top
R16  128.44,26.04 270 bottom
R17  130.98,26.04 270 bottom
R18  125.91,26.04 270 bottom
R19  123.37,26.04 270 bottom
R20  73.84,35.56 180 top
R21  73.84,33.02 180 top
R22  73.84,30.48 180 top
R23  73.84,27.94 180 top
R24  73.84,25.4 180 top
R25  73.84,38.1 180 top
SCLK  63.04,35.56 0 top
SW_#CS  127.17,33.66 180 top
SW_SPI  116.38,33.66 180 top
U$1  33.2,15.24 180 top
U$2  33.2,8.89 180 top
U$3  63.67,15.24 180 top
U$4  63.67,8.89 180 top
U$5  94.16,15.24 180 top
U$6  94.16,8.89 180 top
U$7  124.64,15.24 180 top
U$8  124.64,8.89 180 top
X1  11.3,21 270 top

### Tracks (layer width: path | path; a pad name or v marks a point on that pad's centre or on a via)
#CS
  Top 0.2: R5.2 59.59,27.95 63,27.95 #CS.1 63.16,27.95 72.75,27.95 R23.2
#OE
  Top 0.2: R6.2 59.59,25.51 62.03,25.51 62.35,25.19 62.84,25.19 63,25.35 #OE.1 63.16,25.51 63.97,26.32 64.3,26.32 65.11,25.51 72.75,25.51 R24.2
#RESET
  Top 0.2: R7.2 59.59,38.19 62.03,38.19 62.35,37.86 62.84,37.86 63,38.02 #RESET.1 63.16,38.19 72.75,38.19 R25.2
+3V3  (via drill 0.2)
  Top 0.2: EK-TM4C1294XL.98 133.04,53.79 134.5,52.33 134.5,47.94 133.04,46.48 JP3.97 | v30.82,36.4 30.5,36.73 29.85,36.73 C1.2 | v66.9,31.52 67.06,31.52 72.1,36.56 72.91,36.56 73.4,37.05 73.56,37.05 73.73,37.21 73.89,37.21 74.7,38.02 R25.1
  Bottom 0.2: JP3.97 133.04,46.31 133.04,42.41 138.56,36.89 C20.+ | JP3.2 11,48.91 11,51.35 EK-TM4C1294XL.1 10.84,51.51 10.84,52.49 9.86,53.46 9.86,54.27 10.51,54.92 11.49,54.92 12.14,54.27 | v66.9,31.52 60.72,31.52 56.83,27.62 50.81,27.62 50.65,27.79 IC1.16 50.49,27.79 50,27.3 38.95,27.3 30.82,35.42 v30.82,36.4 24.49,36.4 15.06,45.83 15.06,46.31 13.92,47.45 13.44,47.45 12.46,48.42 12.46,53.95 12.14,54.27 | 12.14,54.27 14.41,56.55 129.14,56.55 131.74,53.95 132.88,53.95 EK-TM4C1294XL.98
F_+5V  (via drill 0.2)
  Top 0.2: R11.1 110.45,22.1 110.45,19.18 R10.1 110.45,19.01 110.45,16.41 109.31,15.28 U$5.1 | R15.1 140.84,22.1 140.84,19.18 R14.1 140.84,19.01 140.84,16.41 139.7,15.28 U$7.1 | IC5.10 24.65,34.29 23.02,34.29 11,46.31 JP3.1 | v49.03,23.4 49.51,22.91 49.51,22.26 R4.1 49.51,22.1 49.51,19.18 R3.1 49.51,19.01 49.51,16.41 48.38,15.28 U$1.1 | U$3.1 78.76,15.28 79.9,16.41 79.9,19.01 R8.1 79.9,19.18 79.9,22.1 R9.1 79.9,22.26 79.9,28.93 83.96,32.99 84.45,32.99 | 87.7,34.77 v86.56,33.64 85.75,32.83 84.78,32.83 C18.2 | 87.7,34.77 87.7,36.4 IC4.24 | 84.45,32.99 v84.45,33.8 | 84.45,32.99 84.61,32.83 C18.2 | v92.25,34.77 92.09,34.61 87.86,34.61 87.7,34.77 | 84.45,32.99 C18.2
  Top 0.5: U$2.1 U$1.1 | U$4.1 U$3.1 | U$6.1 U$5.1 | U$8.1 U$7.1
  Bottom 0.2: U$5.1 109.31,15.28 112.73,15.28 114.03,16.57 116.46,16.57 119.06,13.97 138.4,13.97 139.54,15.11 U$7.1 139.54,15.28 139.54,29.57 138.72,30.39 C19.+ 138.56,30.55 137.91,30.55 131.09,37.38 SW_#CS.1 | C17.2 99.08,36.73 100.05,35.75 113.38,35.75 115,37.38 SW_SPI.3 115.16,37.54 117.6,37.54 SW_SPI.1 117.76,37.54 123.29,37.54 SW_#CS.7 123.45,37.54 125.89,37.54 SW_#CS.5 126.05,37.54 128.32,37.54 SW_#CS.3 128.49,37.54 130.92,37.54 SW_#CS.1 | JP3.98 132.88,48.91 132.88,51.35 EK-TM4C1294XL.97 | EK-TM4C1294XL.99 138.07,51.35 138.07,48.91 JP3.100 137.91,48.91 133.04,48.91 JP3.98 | JP3.98 132.88,48.75 132.88,47.77 131.41,46.31 131.41,37.86 131.09,37.54 SW_#CS.1 | 11.32,46.8 11,46.48 JP3.1 11.32,46.8 | 11.32,46.8 11.97,47.45 11.97,51.84 11,52.81 11,53.79 EK-TM4C1294XL.2 | v49.03,23.4 48.86,23.56 48.86,25.35 C2.2 | v86.56,33.64 85.1,35.1 85.1,36.73 C16.2 | IC2.16 83.31,33.8 v84.45,33.8 85.42,32.83 85.42,29.09 84.29,27.95 82.34,27.95 82.01,28.27 68.04,28.27 66.58,26.81 62.67,26.81 62.19,27.3 53.41,27.3 51.62,25.51 48.86,25.51 C2.2 | v92.25,34.77 93.23,33.8 97.12,33.8 IC3.16 | 11.32,46.8 26.76,31.36 34.4,31.36 39.27,26.49 47.72,26.49 48.7,25.51 C2.2 | U$6.1 109.15,8.94 106.88,8.94 105.58,10.24 101.03,10.24 100.7,10.56 93.06,10.56 89.81,7.31 80.23,7.31 78.76,8.78 U$4.1
F_+12V
  Bottom 0.2: JP3.99 138.07,46.48 138.07,47.45 139.05,48.42 139.05,52.81 138.07,53.79 EK-TM4C1294XL.100
F_-12V
  Bottom 0.2: JP3.102 140.51,48.91 140.51,51.35 EK-TM4C1294XL.101
GND  (via drill 0.2, 0.5)
  other vias: 37.32,37.47 41.13,37.47 51.93,24.13 46.21,23.81 83.04,39.37 81.14,24.77 94.16,23.5 92.57,22.86 86.22,27.62 85.58,25.4 90.98,29.84 90.34,33.34 105.59,26.67 105.59,24.77 107.81,26.67 107.81,24.77 110.03,26.67 110.67,24.77
  pour Top: 0,0 144.32,0 144.32,58 0,58
  pour Bottom: 0,0 144.32,0 144.32,58 0,58
MISO
  Top 0.2: R22.2 72.75,30.55 65.28,30.55 64.3,29.57 63.97,29.57 63.16,30.39 MISO.1
MOSI
  Top 0.2: R2.2 59.59,32.99 63,32.99 MOSI.1 63.16,32.99 65.11,31.04 67.06,31.04 69.01,32.99 72.75,32.99 R21.2
MUX_#CS  (via drill 0.2)
  Top 0.2: v75.84,27.46 75.51,27.79 74.86,27.79 R23.1 | IC4.1 87.7,26.98 87.16,26.98 86.85,26.67 86.85,26.11 v86.74,25.99
  Bottom 0.2: v86.74,25.99 84.91,25.99 84.31,25.4 81.77,25.4 79.71,27.46 v75.84,27.46
MUX_MISO  (via drill 0.2)
  Top 0.2: v86.89,34.61 83.96,34.61 79.9,30.55 74.86,30.55 R22.1
  Bottom 0.2: v86.89,34.61 87.54,33.96 87.54,32.01 87.86,31.69 95.17,31.69 97.12,29.74 IC3.13
MUX_MOSI  (via drill 0.2)
  Top 0.2: v85.75,35.1 83.96,35.1 81.85,32.99 74.86,32.99 R21.1
  Bottom 0.2: v85.75,35.1 87.21,33.64 87.21,31.85 87.86,31.2 88.51,31.2 IC2.3
MUX_SCLK  (via drill 0.2)
  Top 0.2: v75.84,35.42 74.86,35.42 R20.1
  Bottom 0.2: v75.84,35.42 77.3,35.42 81.04,31.69 84.12,31.69 84.29,31.52 84.29,30.71 83.31,29.74 IC2.13
N$1  (via drill 0.2)
  Top 0.2: v56.5,32.34 57.15,32.99 57.64,32.99 R2.1
  Bottom 0.2: v56.5,32.34 52.6,32.34 50.65,30.39 IC1.14
N$2  (via drill 0.2)
  Top 0.2: v54.22,28.11 56.83,25.51 57.64,25.51 R6.1
  Bottom 0.2: v54.22,28.11 53.09,28.11 51.3,29.9 49.67,29.9 49.35,30.23 49.35,30.88 50.16,31.69 50.49,31.69 IC1.13
N$3  (via drill 0.2)
  Top 0.2: v57.64,29.09 57.64,27.95 R5.1
  Bottom 0.2: v57.64,29.09 57.64,31.85 56.5,32.99 50.65,32.99 IC1.12
N$4  (via drill 0.2)
  Top 0.2: v56.5,35.42 57.64,35.42 R1.1
  Bottom 0.2: v56.5,35.42 51.79,35.42 50.65,34.29 IC1.11
N$5  (via drill 0.2)
  Top 0.2: v56.5,38.02 57.64,38.02 R7.1
  Bottom 0.2: v56.5,38.02 53.25,38.02 50.65,35.42 IC1.10
N$6  (via drill 0.2)
  Top 0.2: v39.6,28.44 35.21,24.05 34.24,24.05 IC5.1
  Bottom 0.2: v39.6,28.44 39.76,28.6 45.94,28.6 46.42,29.09 50.49,29.09 IC1.15
N$7  (via drill 0.2)
  Top 0.2: v38.62,28.27 35.86,25.51 34.24,25.51 IC5.2
  Bottom 0.2: v38.62,28.27 38.95,27.95 44.96,27.95 IC1.1
N$8  (via drill 0.2)
  Top 0.2: v37.81,29.25 35.05,26.49 34.4,26.49 34.24,26.65 IC5.3
  Bottom 0.2: v37.81,29.25 44.96,29.25 IC1.2
N$9  (via drill 0.2)
  Top 0.2: v37.16,29.9 35.05,27.79 34.24,27.79 IC5.4
  Bottom 0.2: v37.16,29.9 37.65,30.39 44.96,30.39 IC1.3
N$10  (via drill 0.2)
  Top 0.2: v100.54,25.68 100.54,26.98 IC4.11
  Bottom 0.2: SW_#CS.4 128.49,29.74 128.49,27.14 R16.1 128.32,26.98 127.35,26 114.19,26 113.54,25.35 101.84,25.35 101.51,25.68 v100.54,25.68
N$11  (via drill 0.2)
  Top 0.2: v36.51,30.39 35.21,29.09 34.24,29.09 IC5.5
  Bottom 0.2: v36.51,30.39 37.81,31.69 44.96,31.69 IC1.4
N$12  (via drill 0.2)
  Top 0.2: v99.24,25.68 99.24,26.98 IC4.10
  Bottom 0.2: SW_#CS.2 130.92,29.74 130.92,27.14 R17.1 130.92,26.98 129.95,26 129.95,24.86 129.14,24.05 101.51,24.05 99.89,25.68 v99.24,25.68
N$13  (via drill 0.2)
  Top 0.2: v35.86,31.04 35.21,30.39 34.24,30.39 IC5.6
  Bottom 0.2: v35.86,31.04 37.81,32.99 44.96,32.99 IC1.5
N$14  (via drill 0.2)
  Top 0.2: v35.54,32.01 35.21,31.69 34.24,31.69 IC5.7
  Bottom 0.2: v35.54,32.01 37.81,34.29 44.96,34.29 IC1.6
N$15  (via drill 0.2)
  Top 0.2: v35.54,33.31 35.21,32.99 34.24,32.99 IC5.8
  Bottom 0.2: v35.54,33.31 37.65,35.42 44.96,35.42 IC1.7
N$16
  Bottom 0.2: R12.1 117.6,27.14 117.6,29.74 SW_SPI.2 117.6,29.9 116.46,29.9 115.49,30.88 105.09,30.88 103.46,29.25 100.54,29.25 97.29,26 IC3.10 97.12,26.16 96.64,26.65 84.61,26.65 84,26.04 IC2.10 83.31,26.16
N$17
  Bottom 0.2: 115.16,27.95 115.16,29.74 SW_SPI.4 | 115.16,27.95 115.16,27.14 R13.1 | IC2.9 83.31,24.86 87.21,24.86 87.7,25.35 89.65,25.35 90.46,26.16 95.5,26.16 96.8,24.86 97.12,24.86 IC3.9 97.29,24.7 100.54,27.95 115.16,27.95
N$18
  Top 0.2: IC4.14 100.54,36.56 100.54,38.02 101.67,39.16 111.26,39.16 118.9,31.52 124.1,31.52 125.89,29.74 SW_#CS.6
  Bottom 0.2: R18.1 125.89,27.14 125.89,29.74 SW_#CS.6
N$19
  Top 0.2: LED2.A 44.47,22.26 47.4,22.26 R4.2
N$20
  Top 0.2: LED1.A 44.47,19.18 47.4,19.18 R3.2
N$21
  Top 0.2: LED3.A 75.03,19.18 77.95,19.18 R8.2
N$22
  Top 0.2: LED4.A 75.03,22.26 77.95,22.26 R9.2
N$23
  Top 0.2: LED5.A 105.41,19.18 108.34,19.18 R10.2
N$24  (via drill 0.2)
  Top 0.2: v101.84,35.1 101.84,36.4 IC4.13
  Bottom 0.2: R19.1 123.45,27.14 123.45,29.74 SW_#CS.8 123.29,29.9 118.09,35.1 v101.84,35.1
N$25
  Top 0.2: LED6.A 105.41,22.26 108.34,22.26 R11.2
N$26
  Top 0.2: LED7.A 135.96,19.18 138.89,19.18 R14.2
N$27
  Top 0.2: LED8.A 135.96,22.26 138.89,22.26 R15.2
PA0
  Bottom 0.2: JP3.73 102.49,46.48 102.49,47.45 103.46,48.42 103.46,52.81 102.49,53.79 EK-TM4C1294XL.74
PA1
  Bottom 0.2: JP3.75 104.92,46.48 104.92,47.45 103.95,48.42 103.95,52.81 104.92,53.79 EK-TM4C1294XL.76
PA2
  Bottom 0.2: IC2.12 83.15,28.6 70.47,28.6 67.06,32.01 57.96,32.01 56.34,33.64 48.54,33.64 45.94,36.24 31.64,36.24 23.67,44.2 18.31,44.2 16.2,46.31 JP3.5 16.2,46.48 17.17,47.45 17.17,51.67 16.2,52.65 16.2,53.79 EK-TM4C1294XL.6
PA3  (via drill 0.2)
  Top 0.2: v102,38.67 102.98,37.7 102.98,35.26 97.94,30.23 97.94,27.14 IC4.9
  Bottom 0.2: v102,38.67 95.83,38.67 88.19,46.31 88.19,54.44 86.73,55.9 20.59,55.9 18.64,53.95 EK-TM4C1294XL.8 18.48,53.79 17.5,52.81 17.5,48.42 18.48,47.45 18.48,46.48 JP3.7
PA4  (via drill 0.2)
  Top 0.2: v76,36.56 v78.92,39.49 | v24.65,44.36 24.32,44.69 22.86,44.69 21.24,46.31 JP3.9
  Bottom 0.2: v78.92,39.49 80.7,39.49 81.77,38.42 85.2,38.42 85.91,37.7 85.91,35.91 86.08,35.75 86.56,35.75 88.51,33.8 IC2.1 | v76,36.56 59.1,36.56 56.5,39.16 29.85,39.16 v24.65,44.36 | EK-TM4C1294XL.10 21.07,53.79 21.07,52.81 20.1,51.84 20.1,47.45 21.07,46.48 JP3.9
PA5
  Bottom 0.2: IC3.12 97.29,28.6 97.94,29.25 98.1,29.25 98.59,29.74 98.59,34.12 95.66,37.05 93.88,37.05 86.08,44.85 86.08,54.44 84.94,55.58 25.3,55.58 EK-TM4C1294XL.12 23.67,53.79 24.81,52.65 24.81,48.59 23.67,47.45 23.67,46.48 JP3.11
PA6
  Bottom 0.2: JP3.26 41.55,48.91 41.55,51.35 EK-TM4C1294XL.25
PA7
  Bottom 0.2: JP3.28 43.99,48.91 43.99,51.35 EK-TM4C1294XL.27
PB0
  Bottom 0.2: JP3.57 82.17,46.48 82.17,47.45 83.15,48.42 83.15,52.81 82.17,53.79 EK-TM4C1294XL.58
PB1
  Bottom 0.2: JP3.59 84.61,46.48 84.61,47.45 83.64,48.42 83.64,52.81 84.61,53.79 EK-TM4C1294XL.60
PB2
  Bottom 0.2: JP3.68 94.85,48.91 94.85,51.35 EK-TM4C1294XL.67
PB3
  Bottom 0.2: JP3.70 97.29,48.91 97.29,51.35 EK-TM4C1294XL.69
PB4  (via drill 0.2)
  Top 0.2: v96.15,39.16 96.96,38.35 96.96,37.86 97.29,37.54 97.29,35.26 96.64,34.61 96.64,27.14 IC4.8
  Bottom 0.2: v96.15,39.16 96.15,40.95 91.11,45.99 91.11,53.95 88.84,56.23 16.85,56.23 15.06,54.44 15.06,52.49 16.04,51.51 EK-TM4C1294XL.5 16.04,51.35 16.04,48.91 JP3.6
PB5
  Bottom 0.2: IC2.14 83.15,31.2 68.85,31.2 65.6,34.45 60.72,34.45 56.34,38.84 29.52,38.84 23.84,44.52 21.4,44.52 19.61,46.31 19.61,47.77 18.64,48.75 JP3.8 18.64,48.91 18.64,51.35 EK-TM4C1294XL.7
PC4  (via drill 0.2)
  Top 0.2: v51.62,34.12 41.06,44.69 40.9,44.69 39.92,45.66 39.92,47.12 40.09,47.29 40.09,47.61 38.95,48.75 JP3.24 | IC4.5 92.9,26.98 92.9,25.51 91.76,24.38 85.02,24.38 84.45,24.95 v84.45,28.76
  Bottom 0.2: v84.45,28.76 83.96,29.25 70.31,29.25 65.44,34.12 v51.62,34.12 | EK-TM4C1294XL.23 38.95,51.35 38.95,48.91 JP3.24
PC5  (via drill 0.2)
  Top 0.2: v91.6,25.68 91.6,26.98 IC4.4 | v55.69,26 37.65,44.04 37.65,45.34 37.33,45.66 37.33,45.83 37.49,45.99 37.49,46.64 37.16,46.96 37.16,47.12 37.49,47.45 37.49,47.61 36.35,48.75 JP3.22
  Bottom 0.2: v91.6,25.68 90.46,25.68 90.03,25.24 90.03,23.81 89.67,23.58 58.16,23.58 v55.69,26 | EK-TM4C1294XL.21 36.35,51.35 36.35,48.91 JP3.22
PC6  (via drill 0.2)
  Top 0.2: v53.58,26.81 35.38,45.01 35.38,47.29 33.91,48.75 JP3.20 | IC4.3 90.3,26.98 90.3,25.18 v90.62,24.86
  Bottom 0.2: v53.58,26.81 57.21,23.18 90.03,23.18 90.66,23.81 90.66,24.82 v90.62,24.86 | EK-TM4C1294XL.19 33.91,51.35 33.91,48.91 JP3.20
PC7  (via drill 0.2)
  Top 0.2: v84.94,29.25 88.51,29.25 89,28.76 89,27.14 IC4.2 | v71.45,41.44 v72.42,41.44
  Bottom 0.2: v84.94,29.25 84.94,32.17 84.12,32.99 80.88,32.99 v72.42,41.44 | v71.45,41.44 34.72,41.44 30.18,45.99 30.18,47.77 31.15,48.75 JP3.18 31.31,48.91 31.31,51.35 EK-TM4C1294XL.17
PD0  (via drill 0.2)
  Top 0.2: v94.69,34.29 v95.66,33.31
  Bottom 0.2: v95.66,33.31 96.48,32.5 97.12,32.5 IC3.15 | v94.69,34.29 93.39,34.29 82.5,45.17 81.69,45.17 80.88,45.99 80.88,54.11 80.06,54.92 72.91,54.92 EK-TM4C1294XL.50 71.78,53.95 70.8,54.92 68.85,54.92 68.36,54.44 68.36,45.83 69.01,45.17 69.66,45.17 70.8,46.31 71.78,46.31 JP3.49
PD1
  Bottom 0.2: 70.47,52.81 79.58,52.81 80.55,51.84 80.55,45.83 92.41,33.96 92.41,32.66 92.09,32.34 88.67,32.34 IC2.2 | 70.47,52.81 69.5,53.79 EK-TM4C1294XL.48 | 70.47,52.81 70.47,48.42 69.5,47.45 69.5,46.48 JP3.47
PD2  (via drill 0.2)
  Top 0.2: v91.92,32.83 93.88,30.88 93.88,28.44 93.55,28.11 93.55,26 94.36,25.19 95.17,25.19 95.34,25.35 95.34,26.98 IC4.7 | EK-TM4C1294XL.52 74.54,53.79 76.16,52.16 76.16,52 76,51.84 76,50.54 75.84,50.38 75.84,49.73 76,49.56 76,47.94 74.54,46.48 JP3.51
  Bottom 0.2: v91.92,32.83 91.92,33.48 82.5,42.9 78.92,42.9 75.84,45.99 75.84,51.51 74.86,52.49 74.05,52.49 73.4,51.84 73.4,47.45 74.38,46.48 JP3.51
PD3
  Bottom 0.2: 67.22,46.31 71.94,41.6 71.94,41.27 80.71,32.5 83.15,32.5 IC2.15 | 67.22,46.31 66.9,46.31 JP3.45 67.22,46.31 | 67.22,46.31 67.88,46.96 67.88,51.84 66.9,52.81 66.9,53.79 EK-TM4C1294XL.46
PD4
  Bottom 0.2: JP3.39 59.26,46.48 59.26,47.45 60.24,48.42 60.24,52.81 59.26,53.79 EK-TM4C1294XL.40
PD5
  Bottom 0.2: JP3.37 56.66,46.48 56.66,47.45 55.69,48.42 55.69,52.81 56.66,53.79 EK-TM4C1294XL.38
PD6
  Bottom 0.2: JP3.43 64.46,46.48 64.46,47.61 65.44,48.59 65.44,52.81 64.46,53.79 EK-TM4C1294XL.44
PD7
  Bottom 0.2: JP3.41 61.86,46.48 61.86,47.45 62.84,48.42 62.84,52.81 61.86,53.79 EK-TM4C1294XL.42
PE0
  Bottom 0.2: JP3.13 26.27,46.48 26.27,47.45 27.25,48.42 27.25,52.81 26.27,53.79 EK-TM4C1294XL.14
PE1
  Bottom 0.2: JP3.15 28.88,46.48 28.88,47.45 29.85,48.42 29.85,52.81 28.88,53.79 EK-TM4C1294XL.16
PE2
  Bottom 0.2: JP3.17 31.31,46.48 31.31,47.45 32.29,48.42 32.29,52.81 31.31,53.79 EK-TM4C1294XL.18
PE3
  Bottom 0.2: JP3.19 33.91,46.48 33.91,47.45 34.89,48.42 34.89,52.81 33.91,53.79 EK-TM4C1294XL.20
PE4  (via drill 0.2)
  Top 0.2: v54.22,26.81 36.35,44.69 36.35,46.31 JP3.21
  Bottom 0.2: v54.22,26.81 54.55,26.49 66.74,26.49 68.2,27.95 80.23,27.95 81.53,26.65 83.96,26.65 85.75,28.44 88.51,28.44 IC2.5 | EK-TM4C1294XL.22 36.51,53.79 36.51,52.65 37.49,51.67 37.49,47.45 36.51,46.48 JP3.21
PE5
  Bottom 0.2: IC3.14 97.29,31.2 97.94,31.85 98.1,31.85 98.26,32.01 98.26,33.96 95.5,36.73 93.71,36.73 85.75,44.69 85.75,54.27 84.78,55.25 40.25,55.25 38.95,53.95 EK-TM4C1294XL.24 38.95,53.79 39.92,52.81 39.92,48.42 38.95,47.45 38.95,46.48 JP3.23
PF0
  Bottom 0.2: JP3.65 92.25,47.45 93.39,48.59 93.39,52.65 92.25,53.79 EK-TM4C1294XL.66
PF1
  Bottom 0.2: JP3.67 94.85,46.48 94.85,47.45 95.83,48.42 95.83,52.81 94.85,53.79 EK-TM4C1294XL.68
PF2
  Bottom 0.2: JP3.69 97.29,46.48 97.29,47.45 96.31,48.42 96.31,52.81 97.29,53.79 EK-TM4C1294XL.70
PF3
  Bottom 0.2: JP3.71 99.89,46.48 99.89,47.45 100.86,48.42 100.86,52.81 99.89,53.79 EK-TM4C1294XL.72
PF4
  Bottom 0.2: JP3.63 89.81,46.48 89.81,47.45 90.79,48.42 90.79,52.81 89.81,53.79 EK-TM4C1294XL.64
PG0
  Bottom 0.2: JP3.32 49.03,48.91 49.03,51.35 EK-TM4C1294XL.31
PG1
  Bottom 0.2: JP3.30 46.59,48.91 46.59,51.35 EK-TM4C1294XL.29
PH0  (via drill 0.2)
  Top 0.2: v72.91,39.65 73.24,39.98 87.05,39.98 89,38.02 89,36.56 IC4.23
  Bottom 0.2: v72.91,39.65 70.64,39.65 70.47,39.49 30.18,39.49 24.81,44.85 23.19,44.85 22.21,45.83 22.21,47.77 21.24,48.75 JP3.10 21.24,48.91 21.24,51.35 EK-TM4C1294XL.9
PH1  (via drill 0.2)
  Top 0.2: v72.42,40.14 72.59,40.3 88.03,40.3 90.3,38.02 90.3,36.56 IC4.22
  Bottom 0.2: v72.42,40.14 70.64,40.14 70.31,39.81 30.34,39.81 24.98,45.17 23.35,45.17 22.54,45.99 22.54,47.77 23.51,48.75 JP3.12 23.67,48.91 23.67,51.35 EK-TM4C1294XL.11
PH2  (via drill 0.2)
  Top 0.2: v70.15,40.3 70.31,40.3 70.64,40.62 89,40.62 91.6,38.02 91.6,36.56 IC4.21
  Bottom 0.2: v70.15,40.3 30.82,40.3 25.14,45.99 25.14,47.77 26.11,48.75 JP3.14 26.27,48.91 26.27,51.35 EK-TM4C1294XL.13
PH3  (via drill 0.2)
  Top 0.2: v70.31,40.95 89.98,40.95 92.9,38.02 92.9,36.56 IC4.20
  Bottom 0.2: v70.31,40.95 32.61,40.95 27.74,45.83 27.74,47.77 28.71,48.75 JP3.16 28.71,48.91 28.71,51.35 EK-TM4C1294XL.15
PJ0  (via drill 0.2)
  Top 0.2: v93.71,37.86 94.04,37.54 94.04,36.56 IC4.19
  Bottom 0.2: v93.71,37.86 94.85,37.86 95.34,37.38 97.61,37.38 98.1,37.86 104.11,37.86 JP3.81 112.73,46.48 113.7,47.45 113.7,51.67 112.73,52.65 112.73,53.79 EK-TM4C1294XL.82
PJ1  (via drill 0.2)
  Top 0.2: v95.5,37.86 95.5,36.56 IC4.18
  Bottom 0.2: v95.5,37.86 97.61,37.86 97.94,38.19 103.3,38.19 111.42,46.31 111.42,54.27 112.08,54.92 114.03,54.92 115,53.95 EK-TM4C1294XL.84 115.16,53.79 116.14,52.81 116.14,48.42 115.16,47.45 115.16,46.48 JP3.83
PK0
  Bottom 0.2: JP3.25 41.55,46.48 41.55,47.45 42.53,48.42 42.53,52.81 41.55,53.79 EK-TM4C1294XL.26
PK1
  Bottom 0.2: JP3.27 44.15,46.48 44.15,47.61 45.12,48.59 45.12,52.81 44.15,53.79 EK-TM4C1294XL.28
PK2
  Bottom 0.2: JP3.29 46.59,46.48 46.59,47.45 47.56,48.42 47.56,52.81 46.59,53.79 EK-TM4C1294XL.30
PK3
  Bottom 0.2: JP3.31 49.03,46.48 49.03,47.45 48.05,48.42 48.05,52.81 49.03,53.79 EK-TM4C1294XL.32
PK4
  Bottom 0.2: JP3.78 107.53,48.91 107.53,51.35 EK-TM4C1294XL.77
PK5
  Bottom 0.2: JP3.76 104.92,48.91 104.92,51.35 EK-TM4C1294XL.75
PK6
  Bottom 0.2: JP3.64 89.81,48.91 89.81,51.35 EK-TM4C1294XL.63
PK7
  Bottom 0.2: JP3.60 84.61,48.91 84.61,51.35 EK-TM4C1294XL.59
PL0
  Bottom 0.2: JP3.44 64.3,48.91 64.3,51.35 EK-TM4C1294XL.43
PL1
  Bottom 0.2: JP3.46 66.9,48.91 66.9,51.35 EK-TM4C1294XL.45
PL2
  Bottom 0.2: JP3.48 69.5,48.91 69.5,51.35 EK-TM4C1294XL.47
PL3
  Bottom 0.2: JP3.50 71.94,48.91 71.94,51.35 EK-TM4C1294XL.49
PL4
  Bottom 0.2: EK-TM4C1294XL.65 JP3.66
PL5
  Bottom 0.2: JP3.80 110.12,48.91 110.12,51.35 EK-TM4C1294XL.79
PM0
  Bottom 0.2: JP3.42 61.86,48.91 61.86,51.35 EK-TM4C1294XL.41
PM1
  Bottom 0.2: JP3.40 59.26,48.91 59.26,51.35 EK-TM4C1294XL.39
PM2
  Bottom 0.2: JP3.38 56.66,48.91 56.66,51.35 EK-TM4C1294XL.37
PM3
  Bottom 0.2: JP3.34 51.62,48.91 51.62,51.35 EK-TM4C1294XL.33
PM4
  Bottom 0.2: JP3.91 125.24,46.48 125.24,47.45 124.26,48.42 124.26,52.81 125.24,53.79 EK-TM4C1294XL.92
PM5
  Bottom 0.2: JP3.89 122.8,46.48 122.8,47.45 123.78,48.42 123.78,52.81 122.8,53.79 EK-TM4C1294XL.90
PM6
  Bottom 0.2: JP3.87 120.04,46.48 120.04,47.61 119.06,48.59 119.06,52.81 120.04,53.79 EK-TM4C1294XL.88
PM7
  Bottom 0.2: JP3.85 117.6,46.48 117.6,47.45 116.62,48.42 116.62,52.81 117.6,53.79 EK-TM4C1294XL.86
PN0
  Bottom 0.2: JP3.86 117.6,48.91 117.6,51.35 EK-TM4C1294XL.85
PN1
  Bottom 0.2: JP3.88 120.2,48.91 120.2,51.35 EK-TM4C1294XL.87
PN2
  Bottom 0.2: JP3.90 122.8,48.91 122.8,51.35 EK-TM4C1294XL.89
PN3
  Bottom 0.2: JP3.92 125.24,48.91 125.24,51.35 EK-TM4C1294XL.91
PN4
  Bottom 0.2: JP3.82 112.56,48.91 112.56,51.35 EK-TM4C1294XL.81
PN5
  Bottom 0.2: JP3.84 115.16,48.91 115.16,51.35 EK-TM4C1294XL.83
PP0
  Top 0.2: IC4.17 96.64,36.56 96.64,38.02 90.62,44.04 79.41,44.04 77.14,46.31 JP3.53 77.14,46.48 78.11,47.45 78.11,47.77 77.79,48.1 78.11,48.42 78.11,48.91 78.6,49.4 78.6,49.56 78.28,49.89 78.28,50.05 77.79,50.54 77.79,50.7 78.11,51.02 78.11,52.81 77.14,53.79 EK-TM4C1294XL.54
PP1
  Top 0.2: 79.58,46.31 81.53,44.36 91.6,44.36 97.94,38.02 97.94,36.56 IC4.16 | 79.58,46.31 80.71,47.45 80.71,47.77 80.55,47.94 80.55,49.56 80.71,49.73 80.71,50.38 80.55,50.54 80.55,52.81 79.58,53.79 EK-TM4C1294XL.56 | 79.58,46.31 JP3.55
PP2
  Bottom 0.2: JP3.72 99.89,48.91 99.89,51.35 EK-TM4C1294XL.71
PP3
  Bottom 0.2: JP3.74 102.49,48.91 102.49,51.35 EK-TM4C1294XL.73
PP4
  Bottom 0.2: JP3.77 107.53,46.48 107.53,47.45 108.5,48.42 108.5,52.81 107.53,53.79 EK-TM4C1294XL.78
PP5
  Bottom 0.2: JP3.79 110.12,46.48 110.12,47.45 111.1,48.42 111.1,52.81 110.12,53.79 EK-TM4C1294XL.80
PQ0
  Bottom 0.2: IC2.11 83.31,27.46 84.29,27.46 85.75,28.93 85.75,33.15 80.23,38.67 78.6,38.67 75.51,41.76 75.51,47.77 74.54,48.75 JP3.52 74.54,48.91 74.54,51.35 EK-TM4C1294XL.51
PQ1
  Top 0.2: IC4.6 94.2,27.14 94.2,34.77 94.85,35.42 94.85,37.38 90.3,41.92 79.9,41.92 76,45.83 76,46.8 77.14,47.94 77.14,48.75 JP3.54
  Bottom 0.2: EK-TM4C1294XL.53 76.98,51.35 76.98,48.91 JP3.54
PQ2  (via drill 0.2)
  Top 0.2: v80.06,43.39 v80.06,42.41
  Bottom 0.2: v80.06,42.41 78.44,40.79 78.44,39.33 78.76,39 80.39,39 86.08,33.31 86.08,32.17 87.7,30.55 87.86,30.55 88.51,29.9 IC2.4 | v80.06,43.39 80.06,44.36 78.44,45.99 78.44,47.77 79.41,48.75 JP3.56 79.58,48.91 79.58,51.35 EK-TM4C1294XL.55
PQ3  (via drill 0.2)
  Top 0.2: v98.59,35.26 98.59,37.54 98.26,37.86 98.26,38.19 91.76,44.69 84.78,44.69 83.64,45.83 83.64,47.29 82.17,48.75 JP3.58
  Bottom 0.2: v98.59,35.26 98.91,34.94 98.91,28.76 97.61,27.46 97.29,27.46 IC3.11 | EK-TM4C1294XL.57 82.17,51.35 82.17,48.91 JP3.58
PQ4
  Bottom 0.2: JP3.94 127.84,48.91 127.84,51.35 EK-TM4C1294XL.93
RELAIS_COIL1  (via drill 0.2)
  Top 0.2: LED7.C 133.85,19.01 133.85,17.23 135.8,15.28 U$7.2 | v71.61,22.1 70.96,21.45 70.96,18.2 68.69,15.93 68.36,15.93 67.55,16.74 64.79,16.74 64.62,16.57 63.16,16.57 60.72,14.14 60.72,13.65 54.06,6.99 43.66,6.99 42.53,8.12 42.53,8.45 33.91,17.06 29.04,17.06 24.81,21.29 24.81,24.05 IC5.18
  Bottom 0.2: v71.61,22.1 128.97,22.1 135.8,15.28 U$7.2
RELAIS_COIL2  (via drill 0.2)
  Top 0.2: LED8.C 133.69,22.1 133.69,21.29 132.39,19.99 132.39,12.35 135.8,8.94 U$8.2 | v29.2,17.55 29.2,22.43 26.27,25.35 24.81,25.35 IC5.17
  Bottom 0.2: v29.2,17.55 31.96,14.79 31.96,14.62 39.27,7.31 60.4,7.31 63.33,10.24 69.5,10.24 72.75,6.99 90.46,6.99 93.71,10.24 100.54,10.24 103.14,7.64 121.66,7.64 124.26,10.24 134.5,10.24 135.8,8.94 U$8.2
RELAIS_COIL3  (via drill 0.2)
  Top 0.2: LED5.C 103.3,19.01 v103.3,18.04 103.3,17.88 105.41,15.76 105.41,15.28 U$5.2 | v44.96,26 35.38,35.59 32.77,35.59 32.29,35.1 27.25,35.1 25.79,33.64 23.67,33.64 22.86,32.83 22.86,26.98 23.02,26.81 24.65,26.81 IC5.16
  Bottom 0.2: v103.3,18.04 101.03,20.31 72.75,20.31 70.31,22.75 45.37,22.75 44.94,23.18 44.94,25.98 v44.96,26
RELAIS_COIL4  (via drill 0.2)
  Top 0.2: 101.84,13.81 101.84,19.99 103.14,21.29 103.14,22.1 LED6.C | 101.84,13.81 105.41,10.24 105.41,8.94 U$6.2 | v32.45,17.55 30.99,19.01 30.99,23.24 26.27,27.95 24.81,27.95 IC5.15 | 101.84,13.81 v99.4,11.38
  Bottom 0.2: v32.45,17.55 33.42,16.57 33.59,16.57 42.53,7.64 60.24,7.64 63.16,10.56 69.66,10.56 72.42,7.8 76.16,7.8 78.28,9.91 81.2,9.91 83.48,7.64 89.65,7.64 93.39,11.38 v99.4,11.38
RELAIS_COIL5  (via drill 0.2)
  Top 0.2: LED3.C 72.75,19.01 72.75,17.39 74.86,15.28 U$3.2 | v68.53,16.41 67.88,17.06 63,17.06 59.42,13.49 55.53,13.49 49.35,7.31 43.83,7.31 42.85,8.29 42.85,8.61 31.31,20.15 31.31,24.21 26.27,29.25 24.81,29.25 IC5.14
  Bottom 0.2: v68.53,16.41 73.73,16.41 74.86,15.28 U$3.2
RELAIS_COIL6  (via drill 0.2)
  Top 0.2: LED4.C 72.75,22.1 72.75,21.29 71.29,19.82 71.29,12.51 74.86,8.94 U$4.2 | v38.14,16.41 31.64,22.91 31.64,25.19 26.27,30.55 24.81,30.55 IC5.13
  Bottom 0.2: v38.14,16.41 40.41,14.14 50.65,14.14 53.09,16.57 55.53,16.57 61.21,10.89 69.83,10.89 71.78,8.94 74.86,8.94 U$4.2
RELAIS_COIL7  (via drill 0.2)
  Top 0.2: LED1.C 42.36,19.01 42.36,17.23 44.31,15.28 U$1.2 | v38.79,16.41 31.96,23.24 31.96,26 26.27,31.69 24.81,31.69 IC5.12
  Bottom 0.2: v38.79,16.41 43.17,16.41 44.31,15.28 U$1.2
RELAIS_COIL8
  Top 0.2: 40.9,19.99 42.2,21.29 42.2,22.1 LED2.C | 40.9,19.99 40.9,12.35 44.31,8.94 U$2.2 | 40.9,19.99 35.7,19.99 32.29,23.4 32.29,26.98 26.27,32.99 24.81,32.99 IC5.11
RELAIS_COM1
  Bottom 0.5: U$7.4 117.65,17.14 98.6,17.14 96.06,19.68 70.66,19.68 68.12,22.23 42.72,22.23 34.16,30.78 X1.10
RELAIS_COM2
  Bottom 0.5: X1.11 33.91,28.5 41.45,20.95 66.85,20.95 69.39,18.41 94.79,18.41 101.78,11.43 117.02,11.43 U$8.4
RELAIS_COM3
  Bottom 0.5: U$5.4 87.17,17.14 68.12,17.14 65.58,19.68 40.18,19.68 33.66,26.21 X1.12
RELAIS_COM4
  Bottom 0.5: X1.13 33.4,23.92 38.91,18.41 64.31,18.41 71.3,11.43 86.53,11.43 U$6.4
RELAIS_COM5
  Bottom 0.5: X1.14 33.15,21.64 37.64,17.14 56.69,17.14 U$3.4
RELAIS_COM6
  Bottom 0.5: X1.15 32.89,19.35 40.81,11.43 56.05,11.43 U$4.4
RELAIS_COM7
  Bottom 0.5: U$1.4 26.29,17.07 X1.16
RELAIS_COM8
  Bottom 0.5: U$2.4 25.57,11.43 18.59,11.43 15.24,14.78 X1.17
RELAIS_NC1
  Top 0.5: U$7.3 122.73,13.34 122.73,8.89 115.11,1.27 19.86,1.27 12.88,8.26 7.79,8.26 5.25,10.79 5.25,26.13 X1.19
RELAIS_NC2
  Bottom 0.5: X1.20 5.89,24.48 5.89,10.16 7.79,8.26 12.88,8.26 19.86,1.27 117.02,1.27 U$8.3
RELAIS_NC3
  Top 0.5: U$5.3 92.25,13.34 92.25,8.89 85.27,1.91 20.49,1.91 13.51,8.89 8.43,8.89 5.89,11.43 5.89,22.2 X1.21
RELAIS_NC4
  Bottom 0.5: U$6.3 87.17,1.91 20.49,1.91 13.51,8.89 8.43,8.89 6.52,10.79 6.52,20.55 X1.22
RELAIS_NC5
  Top 0.5: X1.23 6.52,18.26 6.52,12.06 9.06,9.53 14.14,9.53 21.13,2.54 55.42,2.54 61.77,8.89 61.77,13.34 U$3.3
RELAIS_NC6
  Bottom 0.5: U$4.3 57.33,2.54 21.13,2.54 14.14,9.53 9.06,9.53 7.16,11.43 7.16,16.61 X1.24
RELAIS_NC7
  Top 0.5: U$1.3 31.29,13.34 31.29,8.89 29.38,6.99 17.95,6.99 14.78,10.16 9.7,10.16 7.16,12.7 7.16,14.32 X1.25
RELAIS_NC8
  Bottom 0.5: U$2.3 31.29,6.99 17.95,6.99 14.78,10.16 9.7,10.16 8.76,11.1 X1.26
RELAIS_NO1
  Bottom 0.5: X1.1 34.04,29.64 42.08,21.59 67.48,21.59 70.03,19.05 95.42,19.05 102.41,12.06 111.3,12.06 U$7.5
RELAIS_NO2
  Bottom 0.5: X1.2 33.78,27.35 40.81,20.32 66.22,20.32 68.75,17.78 94.16,17.78 101.14,10.79 112.57,10.79 U$8.5
RELAIS_NO3
  Bottom 0.5: X1.3 33.53,25.07 39.55,19.05 64.94,19.05 71.93,12.06 80.82,12.06 U$5.5
RELAIS_NO4
  Bottom 0.5: X1.4 33.27,22.78 38.27,17.78 63.67,17.78 70.66,10.79 82.09,10.79 U$6.5
RELAIS_NO5
  Bottom 0.5: X1.5 33.02,20.5 41.45,12.06 50.34,12.06 U$3.5
RELAIS_NO6
  Bottom 0.5: X1.6 32.77,18.21 40.18,10.79 51.61,10.79 U$4.5
RELAIS_NO7
  Bottom 0.5: U$1.5 22.35,15.92 X1.7
RELAIS_NO8
  Bottom 0.5: X1.8 15.11,13.64 19.86,8.89 U$2.5
RESET
  Bottom 0.2: JP3.93 127.84,46.48 127.84,47.45 128.81,48.42 128.81,52.81 127.84,53.79 EK-TM4C1294XL.94
SCLK  (via drill 0.2)
  Top 0.2: R1.2 59.59,35.59 63,35.59 SCLK.1 | v71.78,35.59 72.75,35.59 R20.2
  Bottom 0.2: v71.78,35.59 63.16,35.59 SCLK.1
VREF
  Bottom 0.2: JP3.33 51.62,46.48 51.62,47.45 52.6,48.42 52.6,52.81 51.62,53.79 EK-TM4C1294XL.34
WAKE
  Bottom 0.2: JP3.96 130.44,48.91 130.44,51.35 EK-TM4C1294XL.95

### Text on the board
tNames: Entwickelt von Tim Schaake | Modulares Messsystem - Modul Relais | Vers. 1.0